# EasyEDA Pro project Ploopy-but-smaller V0.1_2025-08-17.epro, board Trackpad
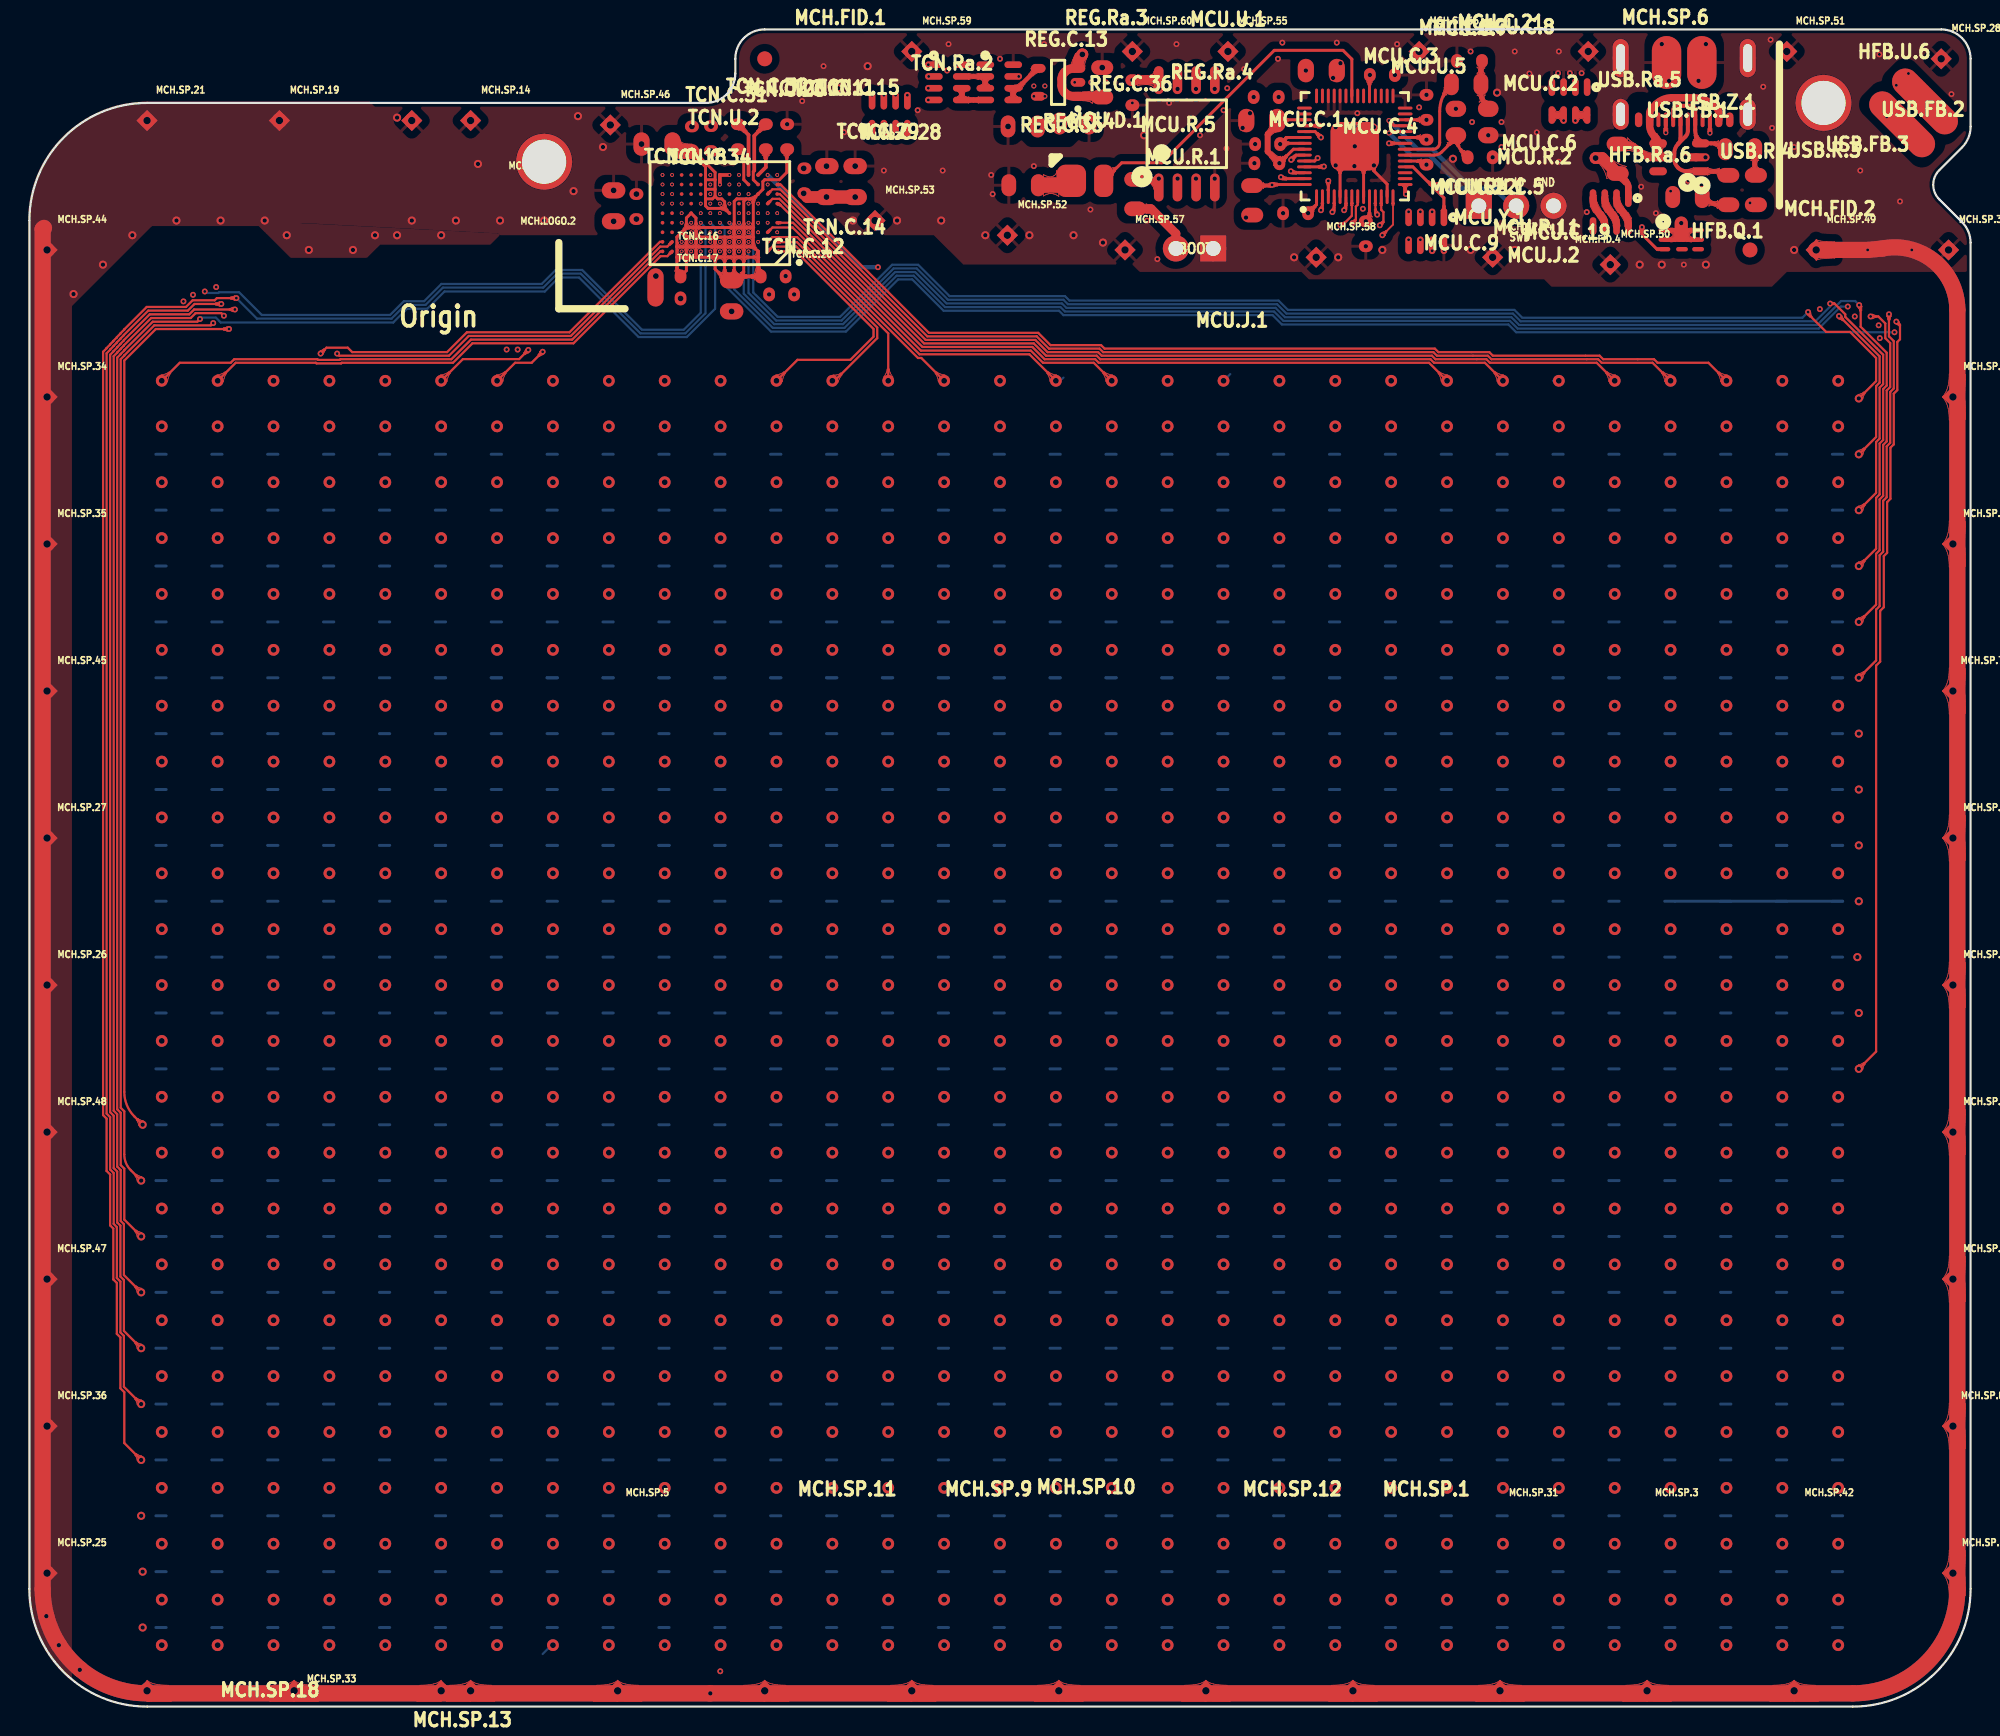
[diagram p0: board, top side]
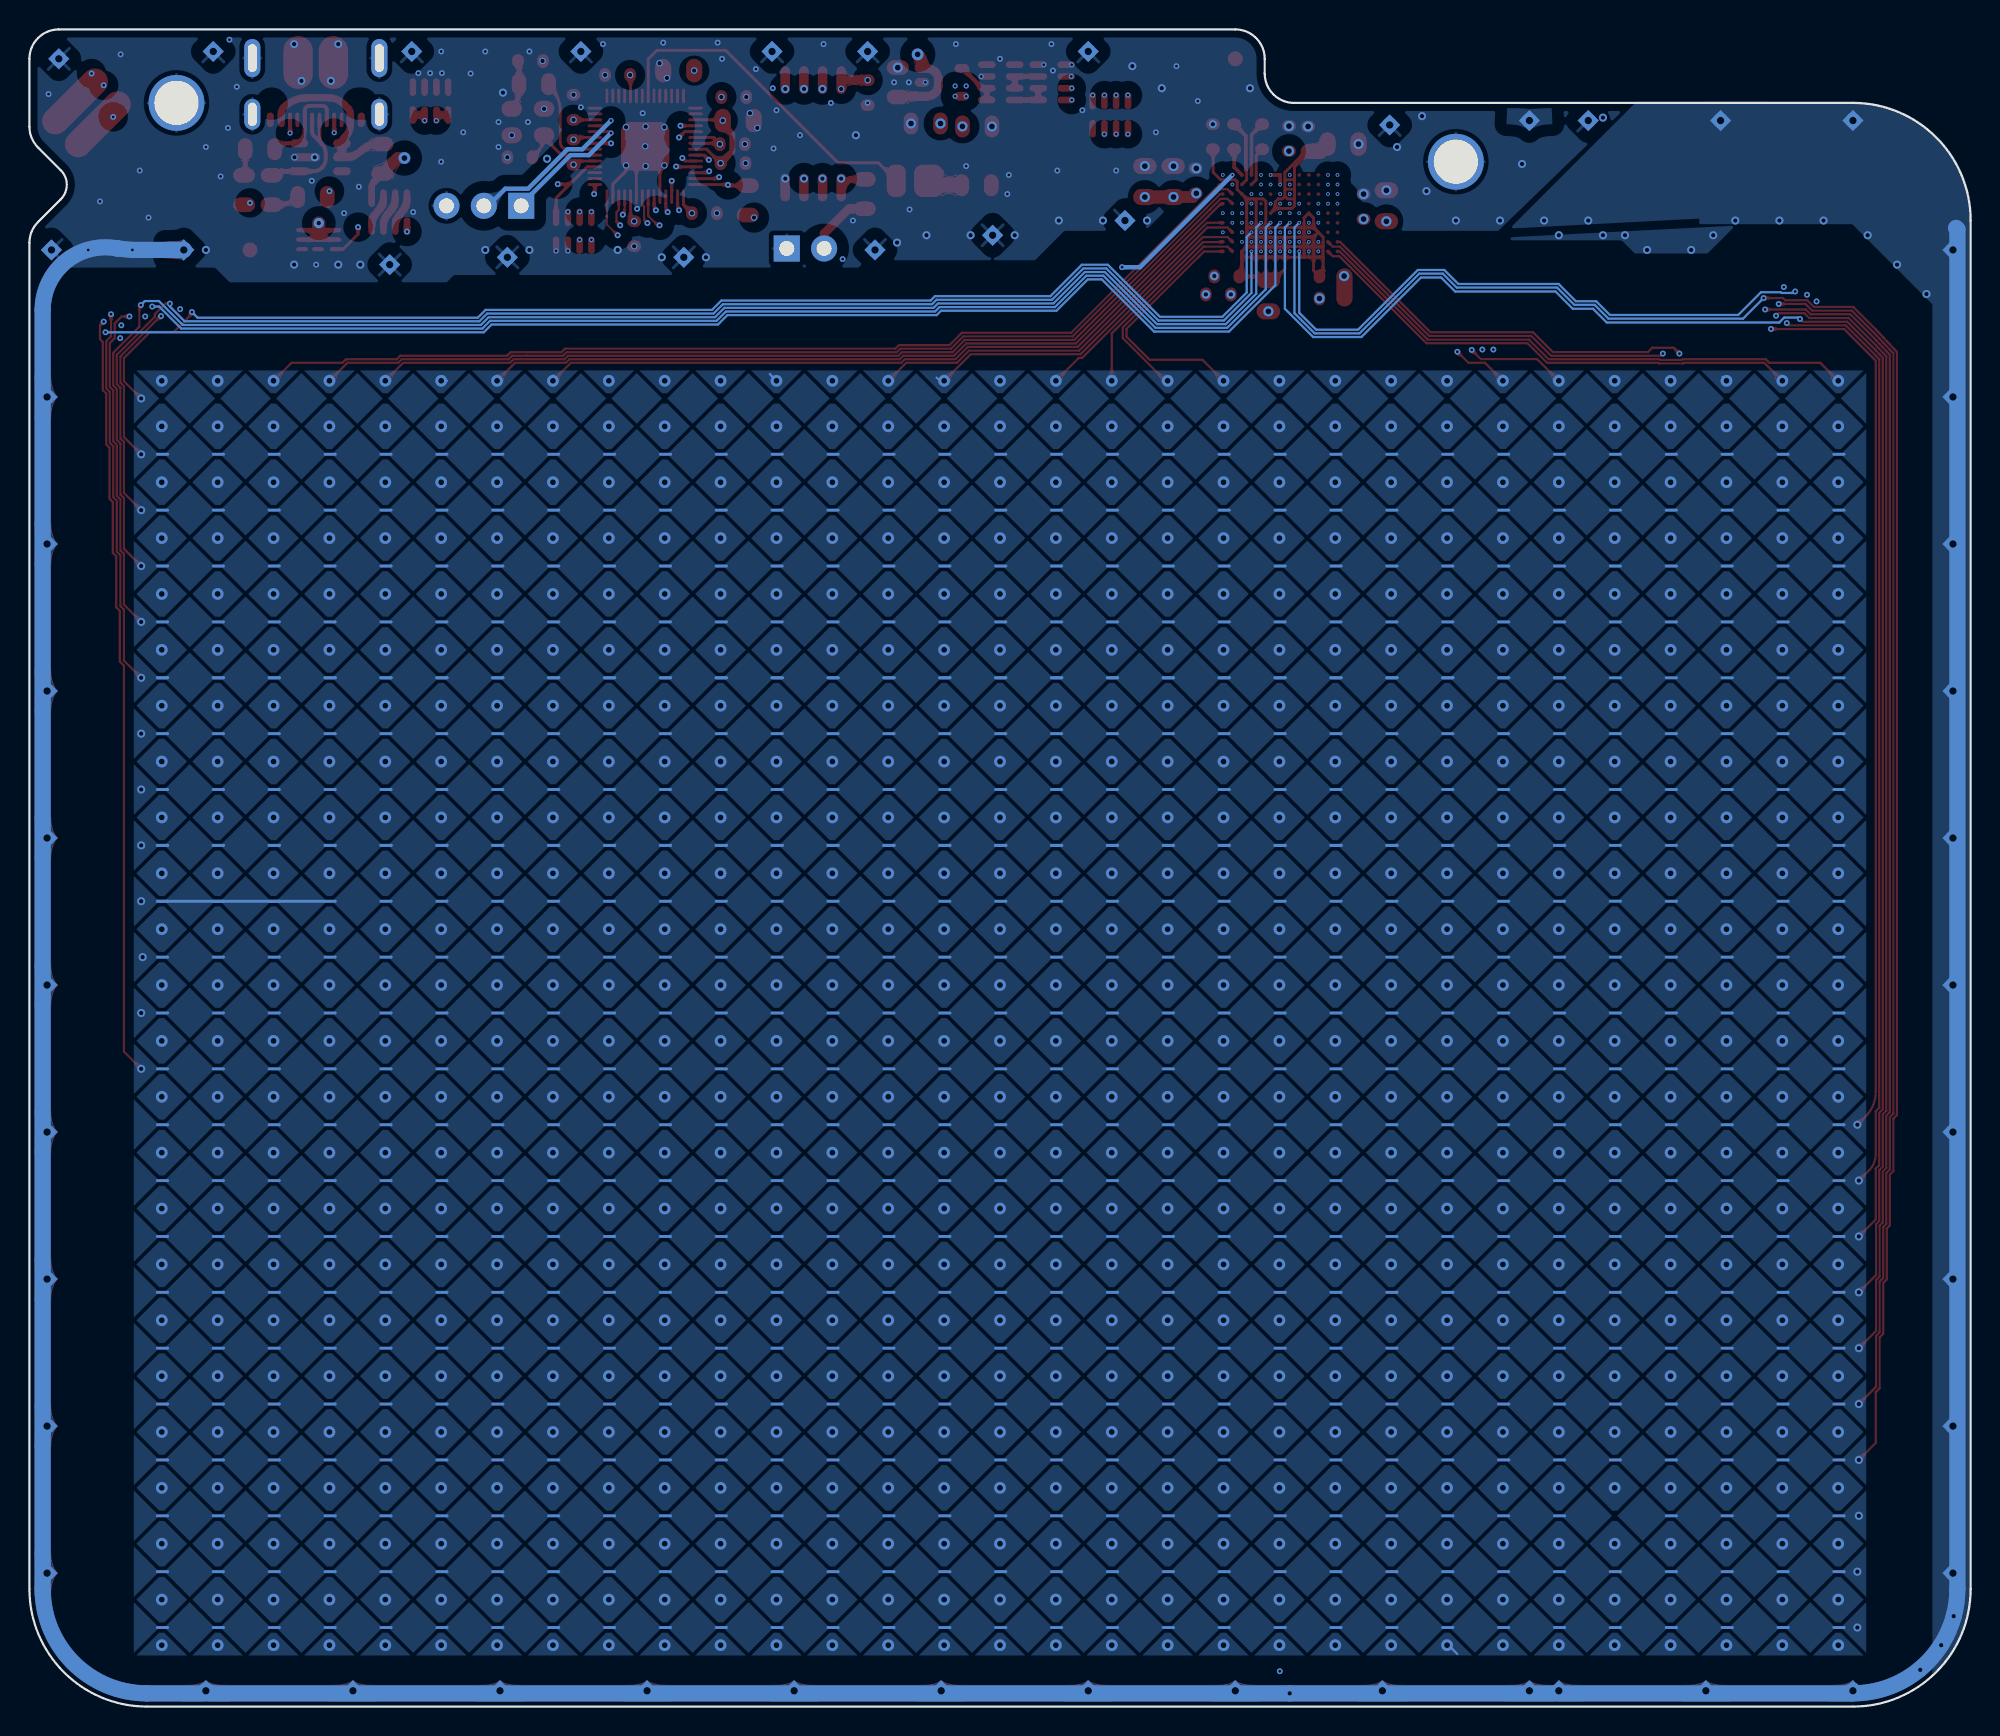
[diagram p1: board, bottom side, seen from below]

Outline 132 x 114.08 mm; copper layers: Top Layer, Inner 1, Inner 2, Inner 3, Inner 4, Bottom Layer. Coordinates in mm from the lower left corner of the outline.
Outline path: 0,101.08 arc(2.34,106.73) 8,109.08 46,109.08 arc(47.42,109.66) 48,111.08 48,112.08 arc(48.59,113.49) 50,114.08 130,114.08 arc(131.42,113.49) 132,112.08 132,107.46 arc(131.85,106.7) 131.42,106.05 129.87,104.5 arc(129.46,103.51) 129.87,102.52 131.42,100.98 arc(131.85,100.33) 132,99.56 132,8 arc(129.66,2.34) 124,0 8,0 arc(2.34,2.34) 0,8 0,101.08
Stack: Top Layer 0.035mm / Dielectric1 0.274mm PP er 4.5 / Inner 1 0.035mm / Dielectric2 0.274mm PP er 4.5 / Inner 2 0.035mm / Dielectric3 0.274mm FR4 er 4.5 / Inner 3 0.035mm / Dielectric4 0.274mm PP er 4.5 / Inner 4 0.035mm / Dielectric5 0.274mm PP er 4.5 / Bottom Layer 0.035mm

## Design rules (mm)
template: User Custom Config
spacing safeClearance (default): track to track 0.089, other pairs 0.152 to 0.3
track width trackWidth (default): min 0.127, default 0.254, max 2.54
differential pair differentialPair (default): width min 0.127, default 0.254, max 2.54; gap min 0.152, default 0.152
via viaSize (default): diameter min 0.5, default 0.61, max 10; hole min 0.3, default 0.305, max 6
net GND uses IgnoreDRC
net 3V3 uses CopperRegion13
net DrivenShield uses CopperRegion8
net Y22 uses IgnoreDRC
pour ie11231 uses CopperRegion2
pour ie11232 uses CopperRegion1
pour ie11233 uses CopperRegion12
pour ie11234 uses CopperRegion7
pour ie11235 uses CopperRegion8
pour ie11237 uses CopperRegion10
pour ie11241 uses CopperRegion6
pour ie11242 uses CopperRegion14
pour ie2408 uses IgnoreDRC

## Placement (name value [footprint] x y rotation side)
HFB.Q.1  CSD16301Q2  [FETs:CSD16301Q2 - SON65P200X80_HS-7M]  112.33 99.78 0 top
HFB.Ra.6  1206 Quad  [Chip_Passives:4x 1R 5% - CAC-80P320X160-8M]  107.53 101.65 270 top
HFB.U.6  MOTOR-VIBRATORY  [Motors:MOTOR-VIBRATORY]  129.96 106.99 135 top
MCH.FID.1  IPC-7351 Fiducial 1mm  [Mechanical:FIDUCIAL_1.5]  50 112.08 90 top
MCH.FID.2  IPC-7351 Fiducial 1mm  [Mechanical:FIDUCIAL_1.5]  117 99.08 90 top
MCH.FID.3  1mm Fiducial for OpenPNP  [Mechanical:FIDUCIAL-NEW]  31.5 103.08 90 top
MCH.FID.4  1mm Fiducial for OpenPNP  [Mechanical:FIDUCIAL-NEW]  104 98.08 90 top
MCH.LOGO.2  Coordinate system marker for assembly  [Graphics:Coordinate System]  36 95.08 0 top
MCH.SP.1  Spark Gap  [PCBFeatures:SparkGap]  90 1.08 90 top
MCH.SP.3  Spark Gap  [PCBFeatures:SparkGap]  110 1.08 90 top
MCH.SP.5  Spark Gap  [PCBFeatures:SparkGap]  40 1.08 90 top
MCH.SP.6  Spark Gap  [PCBFeatures:SparkGap]  106 112.58 90 top
MCH.SP.7  Spark Gap  [PCBFeatures:SparkGap]  130.8 69.08 90 top
MCH.SP.8  Spark Gap  [PCBFeatures:SparkGap]  130.8 19.08 90 top
MCH.SP.9  Spark Gap  [PCBFeatures:SparkGap]  60 1.08 90 top
MCH.SP.10  Spark Gap  [PCBFeatures:SparkGap]  70 1.08 90 top
MCH.SP.11  Spark Gap  [PCBFeatures:SparkGap]  50 1.08 90 top
MCH.SP.12  Spark Gap  [PCBFeatures:SparkGap]  80 1.08 90 top
MCH.SP.13  Spark Gap  [PCBFeatures:SparkGap]  30 1.08 90 top
MCH.SP.14  Spark Gap  [PCBFeatures:SparkGap]  30 107.88 90 top
MCH.SP.16  Spark Gap  [PCBFeatures:SparkGap]  130.8 89.08 90 top
MCH.SP.17  Spark Gap  [PCBFeatures:SparkGap]  130.8 79.08 90 top
MCH.SP.18  Spark Gap  [PCBFeatures:SparkGap]  8 1.08 90 top
MCH.SP.19  Spark Gap  [PCBFeatures:SparkGap]  17 107.88 90 top
MCH.SP.21  Spark Gap  [PCBFeatures:SparkGap]  8 107.88 90 top
MCH.SP.25  Spark Gap  [PCBFeatures:SparkGap]  1.2 9.08 90 top
MCH.SP.26  Spark Gap  [PCBFeatures:SparkGap]  1.2 49.08 90 top
MCH.SP.27  Spark Gap  [PCBFeatures:SparkGap]  1.2 59.08 90 top
MCH.SP.28  Spark Gap  [PCBFeatures:SparkGap]  130 112.08 90 top
MCH.SP.29  Spark Gap  [PCBFeatures:SparkGap]  130.8 59.08 90 top
MCH.SP.30  Spark Gap  [PCBFeatures:SparkGap]  130.8 39.08 90 top
MCH.SP.31  Spark Gap  [PCBFeatures:SparkGap]  100 1.08 90 top
MCH.SP.32  Spark Gap  [PCBFeatures:SparkGap]  28 1.08 90 top
MCH.SP.33  Spark Gap  [PCBFeatures:SparkGap]  18 1.08 90 top
MCH.SP.34  Spark Gap  [PCBFeatures:SparkGap]  1.2 89.08 90 top
MCH.SP.35  Spark Gap  [PCBFeatures:SparkGap]  1.2 79.08 90 top
MCH.SP.36  Spark Gap  [PCBFeatures:SparkGap]  1.2 19.08 90 top
MCH.SP.38  Spark Gap  [PCBFeatures:SparkGap]  130.5 99.08 90 top
MCH.SP.39  Spark Gap  [PCBFeatures:SparkGap]  130.8 49.08 90 top
MCH.SP.40  Spark Gap  [PCBFeatures:SparkGap]  130.8 29.08 90 top
MCH.SP.41  Spark Gap  [PCBFeatures:SparkGap]  130.8 9.08 90 top
MCH.SP.42  Spark Gap  [PCBFeatures:SparkGap]  120 1.08 90 top
MCH.SP.43  Spark Gap  [PCBFeatures:SparkGap]  26 107.88 90 top
MCH.SP.44  Spark Gap  [PCBFeatures:SparkGap]  1.2 99.08 90 top
MCH.SP.45  Spark Gap  [PCBFeatures:SparkGap]  1.2 69.08 90 top
MCH.SP.46  Spark Gap  [PCBFeatures:SparkGap]  39.5 107.58 90 top
MCH.SP.47  Spark Gap  [PCBFeatures:SparkGap]  1.2 29.08 90 top
MCH.SP.48  Spark Gap  [PCBFeatures:SparkGap]  1.2 39.08 90 top
MCH.SP.49  Spark Gap  [PCBFeatures:SparkGap]  121.5 99.08 90 top
MCH.SP.50  Spark Gap  [PCBFeatures:SparkGap]  107.5 98.08 90 top
MCH.SP.51  Spark Gap  [PCBFeatures:SparkGap]  119.5 112.58 90 top
MCH.SP.52  Spark Gap  [PCBFeatures:SparkGap]  66.5 100.08 90 top
MCH.SP.53  Spark Gap  [PCBFeatures:SparkGap]  57.5 101.08 90 top
MCH.SP.54  Spark Gap  [PCBFeatures:SparkGap]  99.5 98.58 90 top
MCH.SP.55  Spark Gap  [PCBFeatures:SparkGap]  81.5 112.58 90 top
MCH.SP.56  Spark Gap  [PCBFeatures:SparkGap]  94.5 112.58 90 top
MCH.SP.57  Spark Gap  [PCBFeatures:SparkGap]  74.5 99.08 90 top
MCH.SP.58  Spark Gap  [PCBFeatures:SparkGap]  87.5 98.58 90 top
MCH.SP.59  Spark Gap  [PCBFeatures:SparkGap]  60 112.58 90 top
MCH.SP.60  Spark Gap  [PCBFeatures:SparkGap]  75 112.58 90 top
MCU.C.1  0603 X5R  [Chip_Passives:0603 CAPACITOR - CAPC1608X06N]  75 109.78 0 top
MCU.C.2  0805 X5R  [Chip_Passives:0805 - TALL]  87.85 111.28 270 top
MCU.C.3  0603 X5R  [Chip_Passives:0603 capacitor - CAPC1608X06N]  86.1 101.58 270 top
MCU.C.4  0603 X5R  [Chip_Passives:0603 CAPACITOR - CAPC1608X06N]  90.88 100.18 0 top
MCU.C.5  0603 X5R  [Chip_Passives:0603 CAPACITOR - CAPC1608X06N]  95 108.78 180 top
MCU.C.6  0603 X5R  [Chip_Passives:0603 capacitor - CAPC1608X06N]  92 110.98 90 top
MCU.C.7  0603 X5R  [Chip_Passives:0603 capacitor - CAPC1608X06N]  84.2 106.28 270 top
MCU.C.8  0603 X5R  [Chip_Passives:0603 capacitor - CAPC1608X06N]  84.1 109.48 270 top
MCU.C.9  0603  [Chip_Passives:0603 capacitor - CAPC1608X06N]  98.65 105.38 270 top
MCU.C.19  0603  [Chip_Passives:0603 capacitor - CAPC1608X06N]  97.93 111.93 270 top
MCU.C.21  0805 X5R  [Chip_Passives:0805 - TALL]  83.8 107.88 90 top
MCU.C.22  0603 X5R  [Chip_Passives:0603 CAPACITOR - CAPC1608X06N]  95 105.73 0 top
MCU.C.24  0603 X5R  [Chip_Passives:0603 capacitor - CAPC1608X06N]  84.15 104.98 270 top
MCU.D.1  SPMWH1228  [LEDs:SPMWH1228]  71.8 103.78 180 top
MCU.J.1  HEADER2  [Connectors:2x1]  80.5 99.18 270 top
MCU.J.2  HEADER3  [Connectors:3x1]  98.56 102.08 90 top
MCU.R.1  0805  [Chip_Passives:0805]  75.2 102.88 180 top
MCU.R.2  0805  [Chip_Passives:0805]  83.15 102.45 180 top
MCU.R.5  0805  [Chip_Passives:0805]  67.6 103.48 90 top
MCU.R.11  0805  [Chip_Passives:0805]  97.7 110.35 90 top
MCU.Ra.1  1206 Quad  [Chip_Passives:4x 10k 1% - CAC-80P320X160-8M]  94.99 100.35 270 top
MCU.U.1  W25Q16JVSSIQ  [Memory:W25Q128JVS - SOIC127P790X216-8M]  78.7 106.98 90 top
MCU.U.5  RP2040  [MCUs:RP2040 - QFN40P700X700X90_HS-57M]  90.13 106.13 90 top
MCU.Y.1  RH100-12.000-16-3030  [Crystals:RH100-12.000-16-3030]  98.1 107.78 0 top
NOREF  -  [footprint_9941]  122 109.08 0 top
NOREF#2  -  [footprint_9941]  35 105.08 0 top
REG.C.13  0805  [Chip_Passives:0805]  67.55 107.48 90 top
REG.C.35  0805  [Chip_Passives:0805]  72.95 110.48 0 top
REG.C.36  0805  [Chip_Passives:0805]  71.05 107.68 270 top
REG.Ra.3  1206 Quad  [Chip_Passives:4x 10k 1% - CAC-80P320X160-8M]  62.45 110.48 0 top
REG.Ra.4  1206 Quad  [Chip_Passives:4x 1k 1% - CAC-80P320X160-8M]  65.95 110.48 0 top
REG.U.4  AP7330-W5  [PowerSupply:AP7330-W5 - SOT95P270X145-5N]  69.95 110.48 180 top
TCN.C.10  0603 X5R  [Chip_Passives:0603 CAPACITOR - CAPC1608X06N]  48.18 106.78 180 top
TCN.C.11  0603 X5R  [Chip_Passives:0603 CAPACITOR - CAPC1608X06N]  50.08 106.78 180 top
TCN.C.12  0805 X5R  [Chip_Passives:0805 - TALL]  47.75 95.95 180 top
TCN.C.14  0603 X5R  [Chip_Passives:0603 capacitor - CAPC1608X06N]  50.58 97.28 90 top
TCN.C.15  0603 X5R  [Chip_Passives:0603 CAPACITOR - CAPC1608X06N]  51.53 106.78 180 top
TCN.C.16  0603 X5R  [Chip_Passives:0603 capacitor - CAPC1608X06N]  43.43 97.28 270 top
TCN.C.17  0603 X5R  [Chip_Passives:0603 capacitor - CAPC1608X06N]  43.43 95.78 270 top
TCN.C.18  0805 X5R  [Chip_Passives:0805 - TALL]  39.73 102.08 0 top
TCN.C.20  0603 X5R  [Chip_Passives:0603 capacitor - CAPC1608X06N]  51.15 96.05 90 top
TCN.C.23  0805 X5R  [Chip_Passives:0805 - TALL]  56.15 103.73 0 top
TCN.C.26  0603 X5R  [Chip_Passives:0603 CAPACITOR - CAPC1608X06N]  46.35 106.65 180 top
TCN.C.28  0805 X5R  [Chip_Passives:0805 - TALL]  54.23 103.73 0 top
TCN.C.29  0603 X5R  [Chip_Passives:0603 CAPACITOR - CAPC1608X06N]  52.7 103.78 180 top
TCN.C.31  0805 X5R  [Chip_Passives:0805 - TALL]  42.68 106.28 90 top
TCN.C.32  0603 X5R  [Chip_Passives:0603 CAPACITOR - CAPC1608X06N]  45.05 106.63 180 top
TCN.C.34  0603 X5R  [Chip_Passives:0603 CAPACITOR - CAPC1608X06N]  41.28 102.03 180 top
TCN.Ra.2  1206 Quad  [Chip_Passives:4x 1k 1% - CAC-80P320X160-8M]  58.5 108.28 90 top
TCN.U.2  ATMXT1066TD-NHU  [CapSense:ATMXT1066TD-NHU - BGA117C65P13X9_950X700X65]  46.95 101.58 180 top
USB.FB.1  ACML-0805-601-T  [Chip_Passives:0805]  108 105.28 0 top
USB.FB.2  ACML-0805-601-T  [Chip_Passives:0805]  116.33 105.93 90 top
USB.FB.3  ACML-0805-601-T  [Chip_Passives:0805]  115.53 103.15 0 top
USB.J.3  DX07S016JA1R1500  [Connectors:DX07S016JA1R1500]  112.53 110.93 180 top
USB.R.3  0805  [Chip_Passives:0805]  117.4 103.15 0 top
USB.R.4  0805  [Chip_Passives:0805]  112.75 102.68 270 top
USB.Ra.5  1206 Quad  [Chip_Passives:4x 10k 1% - CAC-80P320X160-8M]  104.73 109.2 270 top
USB.Z.1  IP4220CZ6,125  [Diodes:PESD3V3S4UD - SOT95P275X110-6N]  112.2 105.38 180 top

## Footprints (pads in the part's own frame, mm; a bottom-side part is the same pattern mirrored in y, then rotated)
CapSense:ATMXT1066TD-NHU - BGA117C65P13X9_950X700X65
  round 0.25 smd: A1(-3.9,2.6) A2(-3.25,2.6) A3(-2.6,2.6) A4(-1.95,2.6) A5(-1.3,2.6) A6(-0.65,2.6) A7(0,2.6) A8(0.65,2.6) A9(1.3,2.6) A10(1.95,2.6) A11(2.6,2.6) A12(3.25,2.6) A13(3.9,2.6) B1(-3.9,1.95) B2(-3.25,1.95) B3(-2.6,1.95) B4(-1.95,1.95) B5(-1.3,1.95) B6(-0.65,1.95) B7(0,1.95) B8(0.65,1.95) B9(1.3,1.95) B10(1.95,1.95) B11(2.6,1.95) B12(3.25,1.95) B13(3.9,1.95) C1(-3.9,1.3) C2(-3.25,1.3) C3(-2.6,1.3) C4(-1.95,1.3) C5(-1.3,1.3) C6(-0.65,1.3) C7(0,1.3) C8(0.65,1.3) C9(1.3,1.3) C10(1.95,1.3) C11(2.6,1.3) C12(3.25,1.3) C13(3.9,1.3) D1(-3.9,0.65) D2(-3.25,0.65) D3(-2.6,0.65) D4(-1.95,0.65) D5(-1.3,0.65) D6(-0.65,0.65) D7(0,0.65) D8(0.65,0.65) D9(1.3,0.65) D10(1.95,0.65) D11(2.6,0.65) D12(3.25,0.65) D13(3.9,0.65) E1(-3.9,0) E2(-3.25,0) E3(-2.6,0) E4(-1.95,0) E5(-1.3,0) E6(-0.65,0) E7(0,0) E8(0.65,0) E9(1.3,0) E10(1.95,0) E11(2.6,0) E12(3.25,0) E13(3.9,0) F1(-3.9,-0.65) F2(-3.25,-0.65) F3(-2.6,-0.65) F4(-1.95,-0.65) F5(-1.3,-0.65) F6(-0.65,-0.65) F7(0,-0.65) F8(0.65,-0.65) F9(1.3,-0.65) F10(1.95,-0.65) F11(2.6,-0.65) F12(3.25,-0.65) F13(3.9,-0.65) G1(-3.9,-1.3) G2(-3.25,-1.3) G3(-2.6,-1.3) G4(-1.95,-1.3) G5(-1.3,-1.3) G6(-0.65,-1.3) G7(0,-1.3) G8(0.65,-1.3) G9(1.3,-1.3) G10(1.95,-1.3) G11(2.6,-1.3) G12(3.25,-1.3) G13(3.9,-1.3) H1(-3.9,-1.95) H2(-3.25,-1.95) H3(-2.6,-1.95) H4(-1.95,-1.95) H5(-1.3,-1.95) H6(-0.65,-1.95) H7(0,-1.95) H8(0.65,-1.95) H9(1.3,-1.95) H10(1.95,-1.95) H11(2.6,-1.95) H12(3.25,-1.95) H13(3.9,-1.95) J1(-3.9,-2.6) J2(-3.25,-2.6) J3(-2.6,-2.6) J4(-1.95,-2.6) J5(-1.3,-2.6) J6(-0.65,-2.6) J7(0,-2.6) J8(0.65,-2.6) J9(1.3,-2.6) J10(1.95,-2.6) J11(2.6,-2.6) J12(3.25,-2.6) J13(3.9,-2.6)
Chip_Passives:4x 1k 1% - CAC-80P320X160-8M
  oval 1.2x0.45 smd: 1(-0.95,1.2) 2(-0.95,0.4) 3(-0.95,-0.4) 4(-0.95,-1.2) 5(0.95,-1.2) 6(0.95,-0.4) 7(0.95,0.4) 8(0.95,1.2)
Chip_Passives:4x 1R 5% - CAC-80P320X160-8M
  oval 1.2x0.45 smd: 1(-0.95,1.2) 2(-0.95,0.4) 3(-0.95,-0.4) 4(-0.95,-1.2) 5(0.95,-1.2) 6(0.95,-0.4) 7(0.95,0.4) 8(0.95,1.2)
Chip_Passives:4x 10k 1% - CAC-80P320X160-8M
  oval 1.2x0.45 smd: 1(-0.95,1.2) 2(-0.95,0.4) 3(-0.95,-0.4) 4(-0.95,-1.2) 5(0.95,-1.2) 6(0.95,-0.4) 7(0.95,0.4) 8(0.95,1.2)
Chip_Passives:0603 capacitor - CAPC1608X06N
  rrect 0.95x0.8 smd: 1(0,-0.85) 2(0,0.85)
Chip_Passives:0603 CAPACITOR - CAPC1608X06N
  rrect 0.95x0.8 smd: 1(0,-0.85) 2(0,0.85)
Chip_Passives:0805
  rrect 1.5x1 smd: 1(0,1.002) 2(0,-1.002)
Chip_Passives:0805 - TALL
  rrect 1.6x1.1 smd: 1(0,1.052) 2(0,-1.052)
Connectors:2x1
  rect 1.778x1.778 hole 1.016: 1(0,0)
  round 1.778 hole 1.016: 2(0,-2.54)
Connectors:3x1
  rect 1.778x1.778 hole 1.016: 1(0,0)
  round 1.778 hole 1.016: 2(0,-2.54) 3(0,-5.08)
Connectors:DX07S016JA1R1500
  round 0.001 hole 0.6: (-3,1.9)
  round 0.001 hole 0.85x0.6: (3,1.9)
  rrect 0.5x1 smd: 1(-3.1,3) 2(-2.35,3) 11(2.35,3) 12(3.1,3)
  rrect 0.27x1 smd: 3(-1.75,3) 4(-1.25,3) 5(-0.75,3) 6(-0.25,3) 7(0.25,3) 8(0.75,3) 9(1.25,3) 10(1.75,3)
  rrect 1.1x2.1 hole 0.6x1.6: SHELL(-4.32,2.625) SHELL(4.32,2.625)
  rrect 1.1x2.6 hole 0.6x1.9: SHELL(-4.32,-1.2) SHELL(4.32,-1.2)
  rrect 2x3.6 smd: SHELL(-1.2,-0.9) SHELL(1.2,-0.9)
Crystals:RH100-12.000-16-3030
  rrect 1.4x1.1 smd: 1(-1.1,-0.9) 2(1.1,-0.9) 3(1.1,0.9) 4(-1.1,0.9)
Diodes:PESD3V3S4UD - SOT95P275X110-6N
  rrect 1.2x0.55 smd: 1(-1.45,0.95) 2(-1.45,0) 3(-1.45,-0.95) 4(1.45,-0.95) 5(1.45,0) 6(1.45,0.95)
FETs:CSD16301Q2 - SON65P200X80_HS-7M
  rrect 0.8x0.3 smd: D(-1.145,0.65) D(-1.145,0) D(1.145,0.65) D(1.145,0) G(-1.145,-0.65) S(0.05,-0.65) S(1.145,-0.65)
  rrect 0.9x0.95 smd: D(0,0.325)
footprint_9941
  round 3.8 hole 3: 4(0,0)
LEDs:SPMWH1228
  rrect 1.3x2.2 smd: 1(-1.25,0)
  rrect 2x2.2 smd: 2(0.95,0)
MCUs:RP2040 - QFN40P700X700X90_HS-57M
  oval 1x0.2 smd: 1(-3.425,2.6) 2(-3.425,2.2) 3(-3.425,1.8) 4(-3.425,1.4) 5(-3.425,1) 6(-3.425,0.6) 7(-3.425,0.2) 8(-3.425,-0.2) 9(-3.425,-0.6) 10(-3.425,-1) 11(-3.425,-1.4) 12(-3.425,-1.8) 13(-3.425,-2.2) 14(-3.425,-2.6) 29(3.425,-2.6) 30(3.425,-2.2) 31(3.425,-1.8) 32(3.425,-1.4) 33(3.425,-1) 34(3.425,-0.6) 35(3.425,-0.2) 36(3.425,0.2) 37(3.425,0.6) 38(3.425,1) 39(3.425,1.4) 40(3.425,1.8) 41(3.425,2.2) 42(3.425,2.6)
  oval 0.2x1 smd: 15(-2.6,-3.425) 16(-2.2,-3.425) 17(-1.8,-3.425) 18(-1.4,-3.425) 19(-1,-3.425) 20(-0.6,-3.425) 21(-0.2,-3.425) 22(0.2,-3.425) 23(0.6,-3.425) 24(1,-3.425) 25(1.4,-3.425) 26(1.8,-3.425) 27(2.2,-3.425) 28(2.6,-3.425) 43(2.6,3.425) 44(2.2,3.425) 45(1.8,3.425) 46(1.4,3.425) 47(1,3.425) 48(0.6,3.425) 49(0.2,3.425) 50(-0.2,3.425) 51(-0.6,3.425) 52(-1,3.425) 53(-1.4,3.425) 54(-1.8,3.425) 55(-2.2,3.425) 56(-2.6,3.425)
  rrect 3.3x3.3 smd: 57(0,0)
Mechanical:FIDUCIAL_1.5
  round 1.016 smd: 1(0,0)
Memory:W25Q128JVS - SOIC127P790X216-8M
  oval 1.9x0.65 smd: 1(-3.65,1.905) 2(-3.65,0.635) 3(-3.65,-0.635) 4(-3.65,-1.905) 5(3.65,-1.905) 6(3.65,-0.635) 7(3.65,0.635) 8(3.65,1.905)
Motors:MOTOR-VIBRATORY
  rrect 5.6x1.8 smd: 1(2.3,1.4) 2(2.3,-0.8)
PCBFeatures:SparkGap
  rect 1.016x1.016 smd rot 45: 1(0,0)
  rect 1.016x1.016 smd far side rot 45: 1(0,0)
PowerSupply:AP7330-W5 - SOT95P270X145-5N
  rrect 1x0.6 smd: 1(-1.35,0.95) 2(-1.35,0) 3(-1.35,-0.95) 4(1.35,-0.95) 5(1.35,0.95)

## Nets
1V1: MCU.C.21.2 MCU.C.22.2 MCU.C.24.2 MCU.U.5.23 MCU.U.5.45 MCU.U.5.50
3V3: MCU.C.1.2 MCU.C.2.2 MCU.C.3.2 MCU.C.4.2 MCU.C.5.2 MCU.C.6.2 MCU.C.7.2 MCU.C.8.2 MCU.R.2.1 MCU.Ra.1.5 MCU.Ra.1.6 MCU.U.1.8 MCU.U.5.1 MCU.U.5.10 MCU.U.5.22 MCU.U.5.26 MCU.U.5.33 MCU.U.5.42 MCU.U.5.43 MCU.U.5.44 MCU.U.5.48 MCU.U.5.49 REG.C.13.2 REG.C.36.2 REG.Ra.3.3 REG.Ra.3.4 REG.U.4.5 TCN.C.17.2 TCN.C.18.2 TCN.C.20.2 TCN.C.23.2 TCN.C.26.2 TCN.C.28.2 TCN.C.29.2 TCN.C.34.2 TCN.Ra.2.6 TCN.Ra.2.7 TCN.Ra.2.8 TCN.U.2.A11 TCN.U.2.D4 TCN.U.2.E4 TCN.U.2.E7 TCN.U.2.E9 TCN.U.2.F4
GND: HFB.Q.1.S MCH.SP.1.1 MCH.SP.3.1 MCH.SP.5.1 MCH.SP.6.1 MCH.SP.7.1 MCH.SP.8.1 MCH.SP.9.1 MCH.SP.10.1 MCH.SP.11.1 MCH.SP.12.1 MCH.SP.13.1 MCH.SP.14.1 MCH.SP.16.1 MCH.SP.17.1 MCH.SP.18.1 MCH.SP.19.1 MCH.SP.21.1 MCH.SP.25.1 MCH.SP.26.1 MCH.SP.27.1 MCH.SP.28.1 MCH.SP.29.1 MCH.SP.30.1 MCH.SP.31.1 MCH.SP.32.1 MCH.SP.33.1 MCH.SP.34.1 MCH.SP.35.1 MCH.SP.36.1 MCH.SP.38.1 MCH.SP.39.1 MCH.SP.40.1 MCH.SP.41.1 MCH.SP.42.1 MCH.SP.43.1 MCH.SP.44.1 MCH.SP.45.1 MCH.SP.46.1 MCH.SP.47.1 MCH.SP.48.1 MCH.SP.49.1 MCH.SP.50.1 MCH.SP.51.1 MCH.SP.52.1 MCH.SP.53.1 MCH.SP.54.1 MCH.SP.55.1 MCH.SP.56.1 MCH.SP.57.1 MCH.SP.58.1 MCH.SP.59.1 MCH.SP.60.1 MCU.C.1.1 MCU.C.2.1 MCU.C.3.1 MCU.C.4.1 MCU.C.5.1 MCU.C.6.1 MCU.C.7.1 MCU.C.8.1 MCU.C.9.2 MCU.C.19.1 MCU.C.21.1 MCU.C.22.1 MCU.C.24.1 MCU.J.1.1 MCU.J.2.3 MCU.R.5.1 MCU.Ra.1.2 MCU.Ra.1.7 MCU.Ra.1.8 MCU.U.1.4 MCU.U.5.5 MCU.U.5.9 MCU.U.5.13 MCU.U.5.16 MCU.U.5.17 MCU.U.5.19 MCU.U.5.27 MCU.U.5.28 MCU.U.5.29 MCU.U.5.30 MCU.U.5.31 MCU.U.5.32 MCU.U.5.34 MCU.U.5.35 MCU.U.5.37 MCU.U.5.38 MCU.U.5.39 MCU.U.5.40 MCU.U.5.41 MCU.U.5.57 MCU.Y.1.2 MCU.Y.1.4 NOREF.4 NOREF#2.4 REG.C.13.1 REG.C.35.1 REG.C.36.1 REG.Ra.3.1 REG.Ra.3.2 REG.Ra.3.8 REG.Ra.4.1 REG.Ra.4.7 REG.Ra.4.8 REG.U.4.2 TCN.C.12.1 TCN.C.14.1 TCN.C.15.1 TCN.C.16.1 TCN.C.17.1 TCN.C.18.1 TCN.C.20.1 TCN.C.23.1 TCN.C.26.1 TCN.C.28.1 TCN.C.29.1 TCN.C.31.1 TCN.C.32.1 TCN.C.34.1 TCN.Ra.2.4 TCN.Ra.2.5 TCN.U.2.B3 TCN.U.2.B11 TCN.U.2.C3 TCN.U.2.D10 TCN.U.2.E5 TCN.U.2.E8 TCN.U.2.G5 TCN.U.2.G7 TCN.U.2.H7 TCN.U.2.H8 TCN.U.2.J6 TCN.U.2.J7 USB.J.3.1 USB.J.3.12 USB.J.3.SHELL USB.Ra.5.1 USB.Ra.5.2 USB.Ra.5.3 USB.Ra.5.4 USB.Z.1.2
DRIVENSHIELD: TCN.U.2.J2
NETHFB.Q.1_D: HFB.Q.1.D HFB.U.6.2
NETHFB.Q.1_G: HFB.Q.1.G MCU.Ra.1.1 MCU.U.5.18
NETHFB.RA.6_1: HFB.Ra.6.1 REG.C.35.2 REG.U.4.1 REG.U.4.3 USB.FB.1.2
NETHFB.RA.6_2: HFB.Ra.6.2 HFB.Ra.6.8
NETHFB.RA.6_3: HFB.Ra.6.3 HFB.Ra.6.7
NETHFB.RA.6_4: HFB.Ra.6.4 HFB.Ra.6.6
NETHFB.RA.6_5: HFB.Ra.6.5 HFB.U.6.1
NETMCU.C.9_1: MCU.C.9.1 MCU.U.5.20 MCU.Y.1.1
NETMCU.C.19_2: MCU.C.19.2 MCU.R.11.2 MCU.Y.1.3
NETMCU.D.1_1: MCU.D.1.1 MCU.U.5.36
NETMCU.D.1_2: MCU.D.1.2 MCU.R.5.2
NETMCU.J.1_2: MCU.J.1.2 MCU.R.1.1
NETMCU.J.2_1: MCU.J.2.1 MCU.U.5.24
NETMCU.J.2_2: MCU.J.2.2 MCU.U.5.25
NETMCU.R.1_2: MCU.R.1.2 MCU.R.2.2 MCU.U.1.1 MCU.U.5.56
NETMCU.R.11_1: MCU.R.11.1 MCU.U.5.21
NETMCU.RA.1_3: MCU.Ra.1.3 MCU.U.5.3 TCN.U.2.F9
NETMCU.RA.1_4: MCU.Ra.1.4 MCU.U.5.15 TCN.U.2.G4
NETMCU.U.1_2: MCU.U.1.2 MCU.U.5.55
NETMCU.U.1_3: MCU.U.1.3 MCU.U.5.54
NETMCU.U.1_5: MCU.U.1.5 MCU.U.5.53
NETMCU.U.1_6: MCU.U.1.6 MCU.U.5.52
NETMCU.U.1_7: MCU.U.1.7 MCU.U.5.51
NETMCU.U.5_2: MCU.U.5.2 TCN.U.2.F8
NETMCU.U.5_4: MCU.U.5.4 TCN.U.2.G8
NETMCU.U.5_6: MCU.U.5.6 TCN.U.2.J8
NETMCU.U.5_7: MCU.U.5.7 TCN.U.2.F7
NETMCU.U.5_8: MCU.U.5.8 TCN.U.2.H6
NETMCU.U.5_11: MCU.U.5.11 TCN.Ra.2.1 TCN.U.2.H5
NETMCU.U.5_12: MCU.U.5.12 TCN.Ra.2.2 TCN.U.2.J5
NETMCU.U.5_14: MCU.U.5.14 TCN.Ra.2.3 TCN.U.2.F6
NETMCU.U.5_46: MCU.U.5.46 USB.R.3.2
NETMCU.U.5_47: MCU.U.5.47 USB.R.4.2
NETREG.RA.3_5: REG.Ra.3.5 REG.Ra.3.6 REG.Ra.4.4
NETREG.RA.3_7: REG.Ra.3.7 REG.Ra.4.2 REG.Ra.4.3
NETREG.RA.4_5: REG.Ra.4.5 REG.Ra.4.6 REG.U.4.4
NETTCN.C.10_1: TCN.C.10.1 TCN.U.2.J4
NETTCN.C.10_2: TCN.C.10.2 TCN.U.2.H4
NETTCN.C.11_1: TCN.C.11.1 TCN.U.2.H3
NETTCN.C.11_2: TCN.C.11.2 TCN.U.2.J3
NETTCN.C.12_2: TCN.C.12.2 TCN.C.14.2 TCN.C.15.2 TCN.C.16.2 TCN.U.2.A3 TCN.U.2.C11 TCN.U.2.E10 TCN.U.2.G3
NETTCN.C.31_2: TCN.C.31.2 TCN.C.32.2 TCN.U.2.E6
NETUSB.FB.1_1: USB.FB.1.1 USB.J.3.2 USB.J.3.11 USB.Z.1.4 USB.Z.1.5
NETUSB.FB.2_1: USB.FB.2.1 USB.J.3.5 USB.J.3.8 USB.Z.1.3
NETUSB.FB.2_2: USB.FB.2.2 USB.R.3.1
NETUSB.FB.3_1: USB.FB.3.1 USB.J.3.6 USB.J.3.7 USB.Z.1.1
NETUSB.FB.3_2: USB.FB.3.2 USB.R.4.1
NETUSB.J.3_3: USB.J.3.3 USB.Ra.5.5 USB.Ra.5.6
NETUSB.J.3_9: USB.J.3.9 USB.Ra.5.7 USB.Ra.5.8
X0: TCN.U.2.A13
X1: TCN.U.2.A12
X2: TCN.U.2.B13
X3: TCN.U.2.B12
X4: TCN.U.2.C13
X5: TCN.U.2.C12
X6: TCN.U.2.D13
X7: TCN.U.2.D12
X8: TCN.U.2.D11
X9: TCN.U.2.E13
X10: TCN.U.2.E12
X11: TCN.U.2.E11
X12: TCN.U.2.F13
X13: TCN.U.2.F12
X14: TCN.U.2.F11
X15: TCN.U.2.G13
X16: TCN.U.2.G12
X17: TCN.U.2.H13
X18: TCN.U.2.H12
X19: TCN.U.2.J13
X20: TCN.U.2.J12
X21: TCN.U.2.A1
X22: TCN.U.2.A2
X23: TCN.U.2.B1
X24: TCN.U.2.B2
X25: TCN.U.2.C1
X26: TCN.U.2.C2
X27: TCN.U.2.D1
X28: TCN.U.2.D2
X29: TCN.U.2.D3
X30: TCN.U.2.E1
X31: TCN.U.2.E2
X32: TCN.U.2.E3
X33: TCN.U.2.F1
X34: TCN.U.2.F2
X35: TCN.U.2.F3
X36: TCN.U.2.G1
X37: TCN.U.2.G2
X38: TCN.U.2.H1
X39: TCN.U.2.H2
X40: TCN.U.2.J1
Y0: TCN.U.2.A10
Y1: TCN.U.2.B10
Y2: TCN.U.2.C10
Y3: TCN.U.2.A9
Y4: TCN.U.2.B9
Y5: TCN.U.2.C9
Y6: TCN.U.2.D9
Y7: TCN.U.2.A8
Y8: TCN.U.2.B8
Y9: TCN.U.2.C8
Y10: TCN.U.2.D8
Y11: TCN.U.2.A7
Y12: TCN.U.2.B7
Y13: TCN.U.2.C7
Y14: TCN.U.2.D7
Y15: TCN.U.2.A6
Y16: TCN.U.2.B6
Y17: TCN.U.2.C6
Y18: TCN.U.2.D6
Y19: TCN.U.2.A5
Y20: TCN.U.2.B5
Y21: TCN.U.2.C5
Y22: TCN.U.2.D5
Y23: TCN.U.2.A4
Y24: TCN.U.2.B4
Y25: TCN.U.2.C4

Pads without a net: MCH.FID.1 1; MCH.FID.2 1; TCN.U.2 F5 F10 G6 G9 G10 G11 H9 H10 H11 J9 J10 J11; USB.J.3 4 10; USB.Z.1 6

## Via types
v1: diameter 0.4, hole 0.2, Top Layer to Bottom Layer, 121 vias
v2: diameter 1.016, hole 0.508, Top Layer to Bottom Layer, 52 vias
v3: diameter 0.55, hole 0.3, Top Layer to Bottom Layer, 82 vias
v4: diameter 0.25, hole 0.15, Top Layer to Bottom Layer, 74 vias
v5: diameter 0.35, hole 0.2, Top Layer to Bottom Layer, 31 vias
v6: diameter 0.45, hole 0.3, Top Layer to Bottom Layer, 37 vias
v7: diameter 0.7, hole 0.4, Top Layer to Bottom Layer, 22 vias
v8: diameter 0.6, hole 0.3, Top Layer to Bottom Layer, 3 vias
v9: diameter 0.7, hole 0.3, Top Layer to Bottom Layer, 2 vias
v10: diameter 0.8, hole 0.4, Top Layer to Bottom Layer, 746 vias

## Routing (per net, layer and track width the routed paths; a pad name or vN(x,y) marks a point on that pad's centre or on a via; arc(x,y) is an arc through that point)
1V1: length 20.5
  Top Layer w0.2: MCU.U.5.50 85.95,105.93 v6(85,104.98) ; MCU.U.5.23 94.76,106.73 arc(94.89,106.75) 95,106.83 ; v6(84.85,107.88) 84.9,107.93 MCU.U.5.45
  Top Layer w0.4: v6(84.85,107.88) 84.85,107.58 84.2,106.93 84.2,105.78 v6(85,104.98)
  Inner 1 w0.4: v6(84.85,107.88) 85.88,108.9 92.68,108.9 v6(95,106.58)
3V3: length 19.4
  Top Layer w0.2: 85.1,106.33 MCU.U.5.49 ; 85.1,106.33 v6(85.05,106.28) ; 85.1,106.33 85.5,106.73 MCU.U.5.48 ; MCU.U.5.33 91.13,110.92 arc(91.13,110.95) v6(91.15,110.98) ; v6(86.95,101.58) 87.53,102.15 MCU.U.5.1 ; MCU.U.5.26 v6(95,107.93) ; 91.13,101.09 MCU.U.5.10 ; v1(92.45,106.33) MCU.U.5.22 ; 90.9,101.09 arc(90.89,101.06) v6(90.88,101.03)
  Top Layer w0.6: v6(75,110.63) MCU.U.1.8
  Top Layer w0.8: v7(52.65,102.93) 52.9,102.68 v7(54.2,102.68)
  Top Layer w0.9: v7(54.2,102.68) 54.2,102.68 v7(56.15,102.68)
  Inner 3 w0.4: v5(57.3,109.6) v5(58.1,109.6) v5(58.9,109.6)
  Inner 3 w0.9: 49.73,97.83 49.73,97.44 arc(49.88,96.69) v8(50.3,96.05)
  vias: v4(44.35,98.98) v4(45.65,101.58) v4(46.95,101.58) v4(48.9,102.23) v4(48.9,101.58) v4(48.9,100.93) v5(61.13,110.08) v5(61.13,109.28) v5(68.3,110.23) v5(68.3,109.53) v5(69.05,110.23) v5(69.05,109.53) v5(93.79,99.77) v5(94.59,99.77) v6(76.8,110.03) v6(82.73,101.28) v6(84.95,109.48) v6(86.8,111.28) v7(39.73,101.03) v7(41.28,101.18) v7(44.28,95.78) v7(46.35,105.8) v7(68.55,107.48) v7(70.05,107.68)
GND: length 849.4
  Top Layer w0.2: MCU.U.5.9 90.73,105.53 v6(90.13,106.13) 89.13,105.13 MCU.U.5.5 ; v6(91.43,104.83) 91.43,104.45 92.33,103.55 MCU.U.5.13 ; MCU.U.5.19 95,105.13
  Top Layer w0.25: v4(46.95,103.53) TCN.U.2.J7 v4(47.6,104.18)
  Top Layer w0.55: 112.5,105.38 113.33,105.38
  Top Layer w1.1: 0.99,100.57 0.9,100.48 0.9,8 arc(0.96,7.07) 1.15,6.15 arc(1.5,5.13) 2.01,4.18 arc(2.67,3.31) 3.46,2.54 arc(5.59,1.32) 8,0.9 ; v9(46.3,0.9) 8.1,0.9 8,1 arc(8.11,0.93) 8.24,0.9 ; v2(121.5,99.08) v1(125,99.08) 126.02,99.18 arc(129.55,98.29) 131.1,95 131.1,8 arc(129.02,2.98) 124,0.9 120.1,0.9 ; 46.28,0.9 119.76,0.9 ; TCN.C.17.1 TCN.C.16.1 ; 119.76,0.97 arc(119.89,1) v2(120,1.08) arc(120.03,1) 120.1,0.97
  Inner 1 w1.1: 49.9,0.9 v9(46.3,0.9) 41.6,0.9
  Inner 2 w0.25: v4(49.55,100.28) 49.88,99.95
  Inner 2 w0.6: 49.99,99.19 49.99,97.27 47.75,95.03 ; 49.99,99.19 51.11,98.07 arc(51.34,97.72) v8(51.43,97.3) ; 49.99,99.19 v4(49.55,99.63) 49.55,97.63 47.75,95.83 47.75,95.03 ; 47.75,95.03 v7(47.75,94.9) ; v8(51.43,97.3) 51.43,97.35 arc(51.23,98.32) 50.68,99.15 49.88,99.95 arc(50.11,99.91) 50.3,99.78 ; v8(51.43,97.3) arc(51.55,96.68) 51.9,96.15 v8(52,96.05) 52,97.45 arc(51.81,98.42) 51.26,99.25 50.73,99.78 arc(50.56,99.85) 50.43,99.98
  Inner 2 w1.1: v9(46.3,0.9) 8.1,0.9 ; 120.1,0.9 124,0.9 arc(129.02,2.98) 131.1,8 ; 46.28,0.9 119.76,0.9 ; v7(42.6,97.3) 42.6,98.4 43.78,99.58 ; 0.9,8 arc(0.96,7.07) 1.15,6.15 arc(1.5,5.13) 2.01,4.18 arc(2.67,3.31) 3.46,2.54 arc(5.59,1.32) 8,0.9
  Inner 3 w0.15: 45.69,107.94 45.91,107.94 v7(46.35,107.5)
  Inner 3 w1.1: v2(50,1.08) arc(49.97,1) 49.9,0.97
  Bottom Layer w1.1: 0.99,100.57 0.9,100.48 0.9,8 arc(0.96,7.07) 1.15,6.15 arc(1.5,5.13) 2.01,4.18 arc(2.67,3.31) 3.46,2.54 arc(5.59,1.32) 8,0.9 ; 8,1 8.1,0.9 v9(46.3,0.9) ; 46.28,0.9 119.76,0.9 ; v2(121.5,99.08) v1(125,99.08) 125.97,99.17 125.97,99.17 arc(126.02,99.18) 126.06,99.19 arc(129.56,98.27) 131.1,95 131.1,8 arc(129.02,2.98) 124,0.9 120.1,0.9 ; 119.76,0.97 arc(119.89,1) v2(120,1.08) arc(120.03,1) 120.1,0.97 ; 8.24,0.97 arc(8.11,1) v2(8,1.08)
  vias: v2(1.2,99.08) v2(1.2,89.08) v2(1.2,79.08) v2(1.2,69.08) v2(1.2,59.08) v2(1.2,49.08) v2(1.2,39.08) v2(1.2,29.08) v2(1.2,19.08) v2(1.2,9.08) v2(8,107.88) v2(17,107.88) v2(18,1.08) v2(26,107.88) v2(28,1.08) v2(30,107.88) v2(30,1.08) v2(39.5,107.58) v2(40,1.08) v2(57.5,101.08) v2(60,112.58) v2(60,1.08) v2(66.5,100.08) v2(70,1.08) v2(74.5,99.08) v2(75,112.58) v2(80,1.08) v2(81.5,112.58) v2(87.5,98.58) v2(90,1.08) v2(94.5,112.58) v2(99.5,98.58) v2(100,1.08) v2(106,112.58) v2(107.5,98.08) v2(110,1.08) v2(119.5,112.58) v2(130,112.08) v2(130.5,99.08) v2(130.8,89.08) v2(130.8,79.08) v2(130.8,69.08) v2(130.8,59.08) v2(130.8,49.08) v2(130.8,39.08) v2(130.8,29.08) v2(130.8,19.08) v2(130.8,9.08) v6(82.5,107.38) v6(83,108.38) v6(83.25,109.48) v6(83.3,104.98) v6(83.35,106.28) v6(85.25,101.58) v6(88.65,110.78) v6(88.83,107.43) v6(88.83,104.83) v6(89.15,111.78) v6(90.1,107.48) v6(90.1,104.78) v6(90.88,99.33) v6(91.43,107.43) v6(92.85,110.98) v6(95,109.63) v6(95,104.88) v6(97,108.68) v6(97.11,111.93) v6(99.2,106.88) v6(99.5,105.38) v6(113.98,105.38) v1(52.55,109.2) v1(54,111.58) v1(55.4,107.08) v1(58.1,104.48) v1(60.4,108.58) v1(62.1,104.48) v1(62.4,111.28) v1(62.5,113.08) v1(65.4,104.18) v1(65.5,102.88) v1(66,112.08) v1(68.3,104.78) v1(69,113.08) v1(72.2,110.48) v1(72.15,101.83) v1(73.2,110.48) v1(75,109.08) v1(76,101.08) v1(76.7,98.45) v1(77.5,109.08) v1(78,113.08) v1(79.6,106.88) v1(81.2,108.58) v1(81.4,105.98) v1(81.45,110.08) v1(82.6,111.38) v1(84.9,112.08) v1(85.2,113.18) v1(88.9,113.18) v1(90.3,108.38) v1(90.68,101.88) v1(93,113.08) v1(94.5,108.78) v1(98,112.58) v1(98.1,107.78) v1(100.1,107.78) v1(100.1,106.08) v1(101,112.58) v1(102,111.08) v1(102.5,107.08) v1(104,112.58) v1(103.95,111.1) v1(104,105.08) v1(104.75,111.1) v1(105.55,111.1) v1(105.9,101.65) v1(109.6,103.38) v1(110.6,101.58) v1(112.5,98.08) v1(112.8,103.78) v1(117.9,110.18) v1(118.4,113.38) v1(118.5,107.38) v1(119,104.08) v1(120,106.08) v1(123.9,101.28) v1(124.5,104.48) v1(125.8,112.38) v1(127.2,102.38) v1(128,99.08) v1(130.7,109.68) v3(1.15,6.15) v3(2,4.18) v3(3,96.08) v3(3.42,2.5) v3(5,98.08) v3(7,100.08) v3(10,101.08) v3(13,101.08) v3(16,101.08) v3(17.5,100.08) v3(19,99.08) v3(22,99.08) v3(23.5,100.08) v3(25,108.08) v3(25,100.08) v3(26,101.08) v3(28,100.08) v3(29,101.08) v3(30.5,104.93) v3(32,101.08) v3(35,101.08) v3(37,103.08) v3(37.3,108.18) v3(39,106.08) v3(49,110.08) v3(51.53,107.63) v3(55,110.08) v3(56,101.08) v3(57,111.58) v3(59,101.08) v3(62,101.08) v3(65,100.08) v3(68,100.08) v3(71,100.08) v3(73,99.58) v3(75.8,106.88) v3(80.6,103.93) v3(86,98.58) v3(89,98.58) v3(92,99.08) v3(96.8,105.28) v3(98,99.08) v3(99.8,109.78) v3(101,99.08) v3(109.5,98.08) v3(111,113.08) v3(111,98.08) v3(111.5,110.58) v3(112.6,105.38) v3(113.5,110.58) v3(114,113.08) v3(114,98.08) v3(120,99.08) v7(39.73,103.13) v7(41.28,102.88) v7(41.62,106.28) v7(45.05,107.48) v7(52.65,104.63) v7(54.2,104.78) v7(56.15,104.78) v7(66.55,107.48) v7(72.05,107.68) v7(72.95,111.48) v4(44.35,99.63) v4(45,100.93) v4(46.3,103.53) v4(46.3,101.58) v4(46.95,102.88) v4(48.25,102.88) v4(48.25,101.58) v5(59.7,109.6) v5(61.13,111.68) v5(61.15,110.88) v5(63.03,111.68) v5(67.28,110.88) v5(71.08,110.48) v5(95.39,101.67) v5(95.39,99.02) v5(96.19,99.02)
DRIVENSHIELD: length 507
  Inner 2 w0.05: 46.65,2.55 46.86,2.56 46.86,2.25 46.84,2.25 46.83,2.25 46.78,2.25 46.65,2.25 46.65,2.55
  Inner 2 w0.3: 7.97,91.68 7.09,91.68 4.42,89.02 4.42,31.36 4.95,30.83 4.95,4.41 6.96,2.4 46.96,2.4 ; 43.11,92.95 55.58,92.95 56.88,94.25 ; 57.7,97.88 v1(57.7,97.9) 57.7,98.03 58.45,98.78 60.8,98.78 62.95,96.63 71,96.63 71.28,96.35 85.33,96.35 85.95,95.73 101.33,95.73 101.8,95.25 119.58,95.25 120.82,96.5 126.13,96.5 128.08,94.55 128.08,66.48 127.7,66.1 127.7,62.68 127.5,62.48 127.5,59 127.28,58.78 127.28,55.13 126.95,54.8 126.95,51.55 126.75,51.35 126.75,47.9 126.53,47.68 126.53,43.93 125.9,43.3 125.9,2.7 125.6,2.4 47.88,2.4 ; 124.2,91.68 123.15,92.73 100.58,92.73 100.08,93.23 84.83,93.23 84.13,93.93 69.7,93.93 69.45,94.18 61.7,94.18 59.33,96.55 58.67,96.55 ; 37.47,97.37 35.7,95.6 28.55,95.6 27.4,94.45 26.53,94.45 25.4,93.33 18.3,93.33 17.65,92.68 9.5,92.68 8.5,91.68
  Inner 3 w0.3: v1(46.98,2.4) 52.85,2.4
  Bottom Layer w0.3: v1(57.7,97.9) 56.48,97.9 v4(50.2,104.18)
NETHFB.Q.1_D: length 25.4
  Top Layer w0.3: 113.47,100.42 113.11,100.42 arc(112.69,100.34) 112.33,100.1 ; 113.47,99.77 113.11,99.77 arc(112.69,99.86) 112.33,100.1 ; 111.18,99.77 111.54,99.77 arc(111.97,99.86) 112.33,100.1 ; 111.18,100.42 111.54,100.42 arc(111.97,100.34) 112.33,100.1
  Top Layer w0.9: 112.33,100.1 112.33,100.9
  Inner 1 w0.9: 126.98,110.28 v1(127.78,111.08) ; v9(112.33,100.9) 117.58,100.9 v1(126.95,110.28)
NETHFB.Q.1_G: length 22.9
  Top Layer w0.2: HFB.Q.1.G 110.68,99.13 109.65,100.15 v1(109.65,100.63) ; MCU.Ra.1.1 96.19,102.62 95.25,103.55 ; 95.25,103.55 94.08,104.73 MCU.U.5.18 ; 95.25,103.55 v1(96.08,103.55)
  Inner 1 w0.2: v1(96.08,103.55) 106.73,103.55 v1(109.65,100.63)
NETHFB.RA.6_1: length 48.5
  Top Layer w0.4: 72.94,109.48 REG.C.35.2 ; REG.U.4.3 71.3,111.65
  Top Layer w0.45: USB.FB.1.2 108.59,103.69 arc(108.69,103.54) 108.73,103.35 HFB.Ra.6.1
  Top Layer w0.6: REG.C.35.2 72.9,109.53 REG.U.4.1 71.01,109.53 arc(70.68,109.59) 70.4,109.78 arc(70.25,110) 70.2,110.26 70.2,110.7 arc(70.25,110.96) 70.4,111.18 arc(70.68,111.36) 71.01,111.43 REG.U.4.3
  Top Layer w0.8: v10(106.5,105.33) 106.95,105.33 USB.FB.1.2 ; 71.3,111.65 arc(71.38,112.05) v10(71.6,112.38)
  Inner 1 w0.8: v10(71.6,112.38) 73.45,112.38 74.3,111.53 81.03,111.53 82.03,110.53 85.8,110.53 86.7,109.63 93.43,109.63 94.2,110.4 97.33,110.4 98.93,108.8 102.38,108.8 105.85,105.33 v10(106.5,105.33)
NETHFB.RA.6_2: length 2.1
  Top Layer w0.5: HFB.Ra.6.8 108.73,100.78 arc(108.64,101.24) 108.38,101.63 108.3,101.71 arc(108.02,102.12) HFB.Ra.6.2
NETHFB.RA.6_3: length 2.1
  Top Layer w0.5: HFB.Ra.6.7 107.93,100.73 arc(107.84,101.19) 107.58,101.58 107.53,101.62 arc(107.23,102.07) HFB.Ra.6.3
NETHFB.RA.6_4: length 2.1
  Top Layer w0.5: HFB.Ra.6.6 arc(107.04,101.14) 106.79,101.51 106.77,101.54 arc(106.44,102.03) HFB.Ra.6.4
NETHFB.RA.6_5: length 23.8
  Top Layer w0.45: v1(106.33,100.33) HFB.Ra.6.5
  Inner 1 w0.45: v1(126.3,108.13) 126,108.13 117.98,100.1 106.55,100.1 v1(106.33,100.33)
NETMCU.C.9_1: length 5.8
  Top Layer w0.2: MCU.U.5.20 95.53,105.53 arc(95.8,105.58) 96.04,105.74 96.88,106.58 arc(96.97,106.72) 97,106.88 ; 97.8,105.38 97.5,105.68 arc(97.13,106.23) 97,106.88 ; MCU.Y.1.1 arc(97,106.88) 97,106.88
NETMCU.C.19_2: length 3.4
  Top Layer w0.27: MCU.Y.1.3 arc(98.83,109.23) 98.7,109.88 MCU.R.11.2 98.7,111.75 arc(98.72,111.85) MCU.C.19.2
NETMCU.D.1_1: length 23.3
  Top Layer w0.2: MCU.U.5.36 89.93,112.05 89.33,112.65 84.65,112.65 77,105 74.28,105 MCU.D.1.1
NETMCU.D.1_2: length 2.3
  Top Layer w1: 68.63,103.48 70.13,103.48 arc(70.52,103.56) MCU.D.1.2
NETMCU.J.1_2: length 4.5
  Top Layer w0.6: MCU.R.1.1 76.28,101.88 77.96,100.19 MCU.J.1.2
NETMCU.J.2_1: length 9.3
  Top Layer w0.2: MCU.U.5.24 92.69,107.13 arc(92.56,107.1) v5(92.45,107.03)
  Bottom Layer w0.3: MCU.J.2.1 98.56,102.17 95.2,105.53 93.95,105.53 v5(92.45,107.03)
NETMCU.J.2_2: length 12.3
  Top Layer w0.2: v5(92.45,107.88) 92.8,107.53 MCU.U.5.25
  Bottom Layer w0.3: MCU.J.2.2 100.8,102.08 99.64,103.24 98.09,103.24 95.4,105.93 94.4,105.93 v5(92.45,107.88)
NETMCU.R.1_2: length 13.6
  Top Layer w0.2: MCU.R.2.2 84.45,103.46 v1(84.5,103.5) 84.53,103.53 MCU.U.5.56
  Top Layer w0.4: MCU.R.1.2 76.24,103.88 MCU.U.1.1
  Inner 1 w0.2: v1(84.5,103.5) 84.13,103.13 77.6,103.13 v3(76.8,103.93)
NETMCU.R.11_1: length 6.8
  Top Layer w0.2: MCU.R.11.1 96.65,110.3 arc(96.09,109.48) 95.9,108.5 95.9,106.38 arc(95.77,106.06) 95.45,105.93 MCU.U.5.21
NETMCU.RA.1_3: length 57.7
  Top Layer w0.15: MCU.U.5.3 v1(88.33,103.78)
  Inner 1 w0.15: v5(94.59,101.67) 94.59,102.64 93.88,103.35 93.1,103.35 92.68,103.78 v1(88.33,103.78) 87.13,103.78 85.88,102.53 77.26,102.53 75.81,103.98 68.21,103.98 64.14,108.05 57.53,108.05 55.88,106.4 49.33,106.4 47.8,104.88 46.53,104.88 45.98,104.33 45.98,102.55 v4(45.65,102.23)
NETMCU.RA.1_4: length 55.5
  Top Layer w0.2: v1(93.6,102.88) 93.55,102.93 MCU.U.5.15
  Inner 1 w0.15: v5(93.79,101.67) 93.6,101.86 v1(93.6,102.88) 93.05,102.88 92.55,103.38 87.2,103.38 86.1,102.28 77.15,102.28 75.7,103.73 68.11,103.73 64.03,107.8 57.65,107.8 56,106.15 49.43,106.15 47.86,104.58 47.58,104.58 47.28,104.28 47.28,103.33 47.4,103.2 48.58,103.2 v4(48.9,102.88)
NETMCU.U.1_2: length 9.1
  Top Layer w0.2: v1(85.1,104.03) 85.2,103.93 MCU.U.5.55
  Inner 1 w0.2: v3(78.08,103.93) 78.55,103.45 83.78,103.45 84.35,104.03 v1(85.1,104.03)
NETMCU.U.1_3: length 7.7
  Top Layer w0.2: MCU.U.5.54 85.88,104.33 v1(85.78,104.43)
  Inner 1 w0.2: v1(85.78,104.43) 85.7,104.5 79.9,104.5 v3(79.33,103.93)
NETMCU.U.1_5: length 12.3
  Top Layer w0.2: MCU.U.5.53 88,104.73 v1(88.03,104.75)
  Inner 1 w0.2: v1(88.03,104.75) 88.05,104.78 88.05,105.45 86.78,106.73 82.35,106.73 80.6,108.48 v3(80.6,110.03)
NETMCU.U.1_6: length 11.7
  Top Layer w0.2: v1(87.6,105.33) 87.4,105.13 MCU.U.5.52
  Inner 1 w0.2: v1(87.6,105.33) 87.15,105.78 82.8,105.78 79.33,109.25 v3(79.33,110.03)
NETMCU.U.1_7: length 10.8
  Top Layer w0.2: MCU.U.5.51 86.13,105.53 v1(85.8,105.2)
  Inner 1 w0.2: v3(78.08,110.03) 82.68,105.43 85.58,105.43 v1(85.8,105.2)
NETMCU.U.5_2: length 46.6
  Top Layer w0.15: MCU.U.5.2 87.93,101.88 v1(87.83,101.78)
  Inner 4 w0.15: v4(46.3,102.23) 46.63,102.55 47.1,102.55 47.28,102.73 47.28,104.4 48.68,105.8 80.28,105.8 83.61,102.48 87.13,102.48 v1(87.83,101.78)
NETMCU.U.5_4: length 47.1
  Top Layer w0.15: MCU.U.5.4 88.73,101.78 v1(88.6,101.65)
  Inner 4 w0.15: v4(46.3,102.88) 46.63,103.2 46.63,104.13 48.55,106.05 80.38,106.05 83.71,102.73 87.53,102.73 v1(88.6,101.65)
NETMCU.U.5_6: length 46.8
  Top Layer w0.15: v1(89.4,101.78) 89.53,101.9 MCU.U.5.6
  Inner 4 w0.15: v1(89.4,101.78) 88.2,102.98 83.81,102.98 80.49,106.3 48.43,106.3 v4(46.3,104.18)
NETMCU.U.5_7: length 48.7
  Top Layer w0.15: v1(89.15,100.75) 89.28,100.75 89.93,101.4 MCU.U.5.7
  Inner 4 w0.15: v1(89.15,100.75) 89.18,100.78 87.15,100.78 85.95,101.98 83.4,101.98 80.07,105.3 48.93,105.3 48.58,104.95 48.58,103.35 48.43,103.2 48.13,103.2 47.15,102.23 v4(46.95,102.23)
NETMCU.U.5_8: length 47.7
  Top Layer w0.15: MCU.U.5.8 90.32,102.7 90.32,102.15 90.2,102.03 90.2,101.13 v1(89.98,100.9)
  Inner 4 w0.15: v1(89.98,100.9) 89.65,101.23 87.73,101.23 87.4,101.55 87.4,101.75 86.93,102.23 83.5,102.23 80.18,105.55 48.8,105.55 47.93,104.68 47.93,103.85 v4(47.6,103.53)
NETMCU.U.5_11: length 50.3
  Top Layer w0.15: MCU.U.5.11 91.53,101.6 v1(91.65,101.48)
  Inner 1 w0.15: v1(91.65,101.48) 90.48,101.48 90.35,101.35 89.2,101.35 88.68,100.83 82.38,100.83 81.18,102.03 77.05,102.03 75.6,103.48 68.01,103.48 63.93,107.55 57.9,107.55 v5(57.3,106.95) 56.25,105.9 49.55,105.9 47.93,104.28 47.93,103.85 v4(48.25,103.53)
NETMCU.U.5_12: length 50
  Top Layer w0.15: MCU.U.5.12 91.93,101.8 92.08,101.65 92.08,101 v1(91.83,100.75)
  Inner 1 w0.15: v1(91.83,100.75) 91.43,100.35 88.9,100.35 88.68,100.58 82.28,100.58 81.08,101.78 76.95,101.78 75.5,103.23 67.9,103.23 63.83,107.3 58.45,107.3 v5(58.1,106.95) 56.8,105.65 49.73,105.65 v4(48.25,104.18)
NETMCU.U.5_14: length 52.7
  Top Layer w0.12: v1(92,100.08) 92.73,100.8 MCU.U.5.14
  Inner 1 w0.15: v4(47.6,102.23) 47.93,102.55 49.08,102.55 49.23,102.7 49.23,103.65 50.95,105.38 57.33,105.38 v5(58.9,106.95) 63.68,106.95 67.76,102.88 75.35,102.88 76.7,101.53 80.98,101.53 82.18,100.33 88.55,100.33 88.8,100.08 v1(92,100.08)
NETMCU.U.5_46: length 32.9
  Top Layer w0.2: MCU.U.5.46 v1(87.73,107.53) ; USB.R.3.2 117.31,102.15 arc(117.14,102.18) v1(117,102.28)
  Inner 1 w0.2: v1(87.73,107.53) 87.93,107.53 89.75,105.7 91.88,105.7 93.3,104.28 111.4,104.28 113.4,102.28 v1(117,102.28)
NETMCU.U.5_47: length 27
  Top Layer w0.2: MCU.U.5.47 87.43,107.13 v1(87.83,106.73) ; v1(111.6,103.08) 111.6,103.03 arc(111.64,102.84) USB.R.4.2
  Inner 1 w0.2: v1(87.83,106.73) 88.25,106.73 89.6,105.38 91.7,105.38 93.1,103.98 110.7,103.98 v1(111.6,103.08)
NETREG.RA.3_5: length 2.4
  Top Layer w0.3: REG.Ra.4.4 REG.Ra.3.5 REG.Ra.3.6
NETREG.RA.3_7: length 2.4
  Top Layer w0.3: REG.Ra.4.3 REG.Ra.4.2 REG.Ra.3.7
NETREG.RA.4_5: length 3.1
  Top Layer w0.3: REG.Ra.4.5 REG.Ra.4.6 67.2,110.08 68.55,111.43 REG.U.4.4
NETTCN.C.10_1: length 3.8
  Top Layer w0.25: TCN.C.10.1 48.9,106.9 48.9,104.18
NETTCN.C.10_2: length 2.7
  Top Layer w0.2: TCN.C.10.2 48.58,105.53 48.58,103.85 48.9,103.53
NETTCN.C.11_1: length 4.6
  Top Layer w0.2: TCN.U.2.H3 49.23,103.85 49.23,104.4 49.29,104.47
  Top Layer w0.25: TCN.C.11.1 49.29,106.84 49.29,104.47
NETTCN.C.11_2: length 2
  Top Layer w0.25: TCN.C.11.2 50.08,104.7 TCN.U.2.J3
NETTCN.C.12_2: length 63
  Top Layer w0.2: 48.58,99.3 49.23,99.3 ; 48.58,99.3 48.58,99.95 ; 48.58,99.3 47.93,99.3 ; 48.58,99.3 48.58,98.58 ; 49.23,99.3 TCN.U.2.A3 ; 49.23,99.3 49.23,99.95 ; 46.63,99.3 47.28,99.3 ; 46.63,99.3 45.33,99.3 ; 46.63,99.3 46.63,99.95 ; 46.63,99.3 46.63,98.58 ; 47.28,99.3 47.28,98.58 ; 47.28,99.3 47.93,99.3 ; 47.28,99.3 47.28,99.95 ; 44.68,98.58 44.68,99.3 ; 44.68,98.58 45.33,98.58 ; 44.68,98.58 44.03,98.58 ; 44.68,98.58 44.68,97.68 TCN.C.16.2 44.03,97.53 44.03,98.58 ; 44.68,99.3 44.68,99.95 ; 44.68,99.3 44.03,99.3 ; 44.68,99.3 45.33,99.3 ; 44.03,99.3 44.03,99.95 TCN.U.2.C11 ; 44.03,99.3 44.03,98.58 ; 47.28,98.58 47.93,98.58 ; 47.28,98.58 47.28,97.48 TCN.C.12.2 ; 47.28,98.58 46.63,98.58 ; 45.33,99.3 45.33,99.95 ; 45.33,99.3 45.33,98.58 ; 45.33,98.58 46.63,98.58 ; TCN.C.12.2 47.93,97.18 47.93,98.58 ; TCN.C.12.2 47.4,97.01 46.63,97.78 46.63,98.58 ; TCN.C.12.2 48,97.01 48.58,97.58 48.58,98.58 ; 47.93,98.58 47.93,99.3 ; 47.93,98.58 48.58,98.58 ; 45.33,99.95 46.63,99.95 ; 45.33,99.95 44.68,99.95 ; 45.33,99.95 45.33,100.6 ; TCN.U.2.C11 44.68,99.95 ; TCN.U.2.C11 44.68,100.6 ; 46.63,99.95 47.28,99.95 ; 49.23,99.95 48.58,99.95 ; 49.23,99.95 49.23,100.6 ; 47.93,100.6 48.58,100.6 ; 47.93,100.6 45.33,100.6 ; 47.93,100.6 47.93,99.95 ; 47.93,100.6 47.93,102.38 48.1,102.55 48.75,102.55 ; 48.58,100.6 48.58,102.38 48.75,102.55 ; 48.58,100.6 49.23,100.6 ; 48.58,100.6 48.58,99.95 ; 49.23,100.6 49.23,102.55 ; 49.23,102.55 48.75,102.55 ; 49.23,102.55 TCN.U.2.G3 49.88,103.2 49.88,103.73 50,103.85 51,103.85 51.5,104.35 51.5,105.9 TCN.C.15.2 ; 48.58,99.95 47.93,99.95 ; 47.93,99.3 47.93,99.95 ; 47.93,99.95 47.28,99.95 ; 48.58,98.58 49.55,98.58 ; 44.68,100.6 44.68,101.25 TCN.U.2.E10 45.33,101.25 45.33,100.6 ; 44.68,100.6 45.33,100.6
  Top Layer w0.25: 47.93,97.18 48.02,97.28 TCN.C.14.2 49.55,97.45 TCN.U.2.A3
NETTCN.C.31_2: length 14.5
  Top Layer w0.2: 45.98,103.85 46.63,103.85 ; 45.98,103.85 45.98,103.23 ; 45.98,103.85 45.98,104.73 45.05,105.65 TCN.C.32.2 45.2,105.78 46.63,104.35 46.63,103.85 ; 46.63,103.85 46.63,103.2 ; 46.63,102.73 46.8,102.55 47.08,102.55 47.28,102.35 47.28,101.9 ; 46.63,102.73 46.45,102.55 45.98,102.55 ; 46.63,102.73 46.63,103.2 ; 47.28,101.9 46.15,101.9 45.98,102.08 45.98,102.55 ; 47.28,101.9 TCN.U.2.E6 ; 45.98,103.23 46,103.2 46.63,103.2 ; 45.98,103.23 45.98,102.55
  Top Layer w1: TCN.C.32.2 44.23,105.78 TCN.C.31.2
NETUSB.FB.1_1: length 12
  Top Layer w0.5: 110.47,105.38 USB.Z.1.5 110.75,106.2 arc(110.69,106.53) 110.5,106.8 arc(110.26,107.16) 110.18,107.59 USB.J.3.11 110.18,108.34 arc(110.22,108.54) 110.33,108.7 110.61,108.99 arc(111.1,109.31) 111.68,109.43 113.13,109.43 arc(113.98,109.26) 114.7,108.78 arc(114.83,108.58) 114.88,108.36 USB.J.3.2 ; 110.47,105.38 110.37,105.38 ; 110.47,105.38 arc(109.94,105.48) 109.5,105.78 arc(108.95,106.15) 108.29,106.28
NETUSB.FB.2_1: length 6.6
  Top Layer w0.27: USB.J.3.8 111.78,108.58 arc(111.86,108.79) 112.08,108.88 112.95,108.88 arc(113.18,108.78) 113.28,108.55 USB.J.3.5 113.28,107.23 arc(113.37,106.74) 113.65,106.33 114.36,106.33 arc(114.88,106.22) USB.FB.2.1
NETUSB.FB.2_2: length 1.8
  Top Layer w0.27: USB.FB.2.2 117.33,104.33 arc(117.35,104.24) USB.R.3.1
NETUSB.FB.3_1: length 8.9
  Top Layer w0.27: USB.J.3.7 112.28,106.67 arc(112.24,106.47) 112.13,106.3 ; 112.13,106.3 112.62,106.79 arc(112.74,106.97) 112.78,107.18 USB.J.3.6 ; 112.13,106.3 arc(111.92,106) 111.85,105.64 111.85,105.28 arc(111.92,104.95) 112.1,104.68 arc(112.38,104.49) 112.7,104.43 114.87,104.43 arc(115.22,104.36) USB.FB.3.1
NETUSB.FB.3_2: length 1.9
  Top Layer w0.27: USB.FB.3.2 115.03,102.15 arc(114.34,102.29) USB.R.4.1
NETUSB.J.3_3: length 12.6
  Top Layer w0.27: v5(114.28,107.03) USB.J.3.3
  Top Layer w0.4: USB.Ra.5.5 USB.Ra.5.6
  Inner 1 w0.27: v5(104.33,107.88) 105.85,106.35 113.6,106.35 v5(114.28,107.03)
NETUSB.J.3_9: length 8.4
  Top Layer w0.27: v5(111.28,107.05) USB.J.3.9
  Top Layer w0.4: USB.Ra.5.7 USB.Ra.5.8
  Inner 1 w0.27: v5(105.13,107.88) 106.28,106.73 110.95,106.73 v5(111.28,107.05)
X0: length 124
  Top Layer w0.15: v10(9,90.18) 10.23,91.4 13.69,91.4 13.93,91.64 19.58,91.64 19.62,91.6 21.1,91.6 21.14,91.64 28.69,91.64 30.03,92.98 36.91,92.98 42.91,98.98 43.05,98.98
  Inner 1 w0.15: 9.18,4.08 8.99,4.26 ; 9,4.08 v10(9,4.18) ; 9,90.18 v10(9,90.18) v10(9,87.08) v10(9,83.28) v10(9,79.48) v10(9,75.68) v10(9,71.88) v10(9,68.08) v10(9,64.28) v10(9,60.48) v10(9,56.68) v10(9,52.88) v10(9,49.08) v10(9,45.28) v10(9,41.48) v10(9,37.68) v10(9,33.88) v10(9,30.08) v10(9,26.28) v10(9,22.48) v10(9,18.68) v10(9,14.88) v10(9,11.08) v10(9,7.28) 9,4.26
X1: length 120.8
  Top Layer w0.15: v10(12.8,90.18) 14.03,91.4 19.48,91.4 19.52,91.36 21.2,91.36 21.24,91.4 28.8,91.4 30.13,92.73 37,92.73 42.92,98.65 43.38,98.65 TCN.U.2.A12
  Inner 1 w0.15: 12.8,4 v10(12.8,7.28) v10(12.8,11.08) v10(12.8,14.88) v10(12.8,18.68) v10(12.8,22.48) v10(12.8,26.28) v10(12.8,30.08) v10(12.8,33.88) v10(12.8,37.68) v10(12.8,41.48) v10(12.8,45.28) v10(12.8,49.08) v10(12.8,52.88) v10(12.8,56.68) v10(12.8,60.48) v10(12.8,64.28) v10(12.8,68.08) v10(12.8,71.88) v10(12.8,75.68) v10(12.8,79.48) v10(12.8,83.28) v10(12.8,87.08) v10(12.8,90.18)
  vias: v10(12.8,4.18)
X2: length 117.2
  Top Layer w0.15: 43.05,99.63 42.88,99.63 36.73,93.48 29.75,93.48 28.4,92.13 21.95,92.13 21.65,92.43 20.2,92.43 v1(19.8,92.03)
  Inner 1 w0.15: 16.6,4.11 v10(16.6,7.28) v10(16.6,11.08) v10(16.6,14.88) v10(16.6,18.68) v10(16.6,22.48) v10(16.6,26.28) v10(16.6,30.08) v10(16.6,33.88) v10(16.6,37.68) v10(16.6,41.48) v10(16.6,45.28) v10(16.6,49.08) v10(16.6,52.88) v10(16.6,56.68) v10(16.6,60.48) v10(16.6,64.28) v10(16.6,68.08) v10(16.6,71.88) v10(16.6,75.68) v10(16.6,79.48) v10(16.6,83.28) v10(16.6,87.08) v10(16.6,90.18) 18.45,92.03 v1(19.8,92.03) ; 16.6,4.08 v10(16.6,4.18)
  Bottom Layer w0.15: v10(16.6,90.18) 16.86,90.44
X3: length 114.3
  Top Layer w0.15: v1(20.92,92.03) 21.07,91.88 28.53,91.88 29.88,93.23 36.82,93.23 42.89,99.3 43.38,99.3 TCN.U.2.B12
  Inner 1 w0.15: 20.4,4.26 v10(20.4,7.28) v10(20.4,11.08) v10(20.4,14.88) v10(20.4,18.68) v10(20.4,22.48) v10(20.4,26.28) v10(20.4,30.08) v10(20.4,33.88) v10(20.4,37.68) v10(20.4,41.48) v10(20.4,45.28) v10(20.4,49.08) v10(20.4,52.88) v10(20.4,56.68) v10(20.4,60.48) v10(20.4,64.28) v10(20.4,68.08) v10(20.4,71.88) v10(20.4,75.68) v10(20.4,79.48) v10(20.4,83.28) v10(20.4,87.08) v10(20.4,90.18) 20.4,91.5 v1(20.92,92.03) ; 20.4,4.08 v10(20.4,4.18)
  Bottom Layer w0.15: v10(20.4,90.18) 20.52,90.3
X8:
  vias: v4(44.35,100.93)
X11:
  vias: v4(44.35,101.58)
X12:
  vias: v4(43.05,102.23)
X13:
  vias: v4(43.7,102.23)
X14: length 112.3
  Inner 1 w0.15: 24.2,4.08 v10(24.2,7.28) v10(24.2,11.08) v10(24.2,14.88) v10(24.2,18.68) v10(24.2,64.28) v10(24.2,68.08) v10(24.2,90.18) 25.43,91.4 35.08,91.4 42.83,99.15 42.83,99.16 43.3,99.63 43.3,100.78 43.78,101.25 43.78,101.38 44.05,101.65 44.05,101.93 v4(44.35,102.23) ; 24.2,4.08 v10(24.2,4.18) ; 24.2,4.08 24.2,4
  vias: v10(24.2,87.08) v10(24.2,83.28) v10(24.2,79.48) v10(24.2,75.68) v10(24.2,71.88) v10(24.2,60.48) v10(24.2,56.68) v10(24.2,52.88) v10(24.2,49.08) v10(24.2,45.28) v10(24.2,41.48) v10(24.2,37.68) v10(24.2,33.88) v10(24.2,30.08) v10(24.2,26.28) v10(24.2,22.48)
X15: length 107.5
  Top Layer w0.15: v10(28,90.18) 29.48,91.65 33.3,91.65 v1(33.93,92.28)
  Inner 1 w0.15: v4(43.05,102.88) 42.68,102.5 42.68,101.73 42.3,101.35 42.3,100.43 34.68,92.8 34.45,92.8 v1(33.93,92.28) ; v10(28,90.18) v10(28,68.08) v10(28,64.28) v10(28,18.68) v10(28,14.88) v10(28,11.08) v10(28,7.28) 28,4.11 ; 28,4.08 v10(28,4.18)
  vias: v10(28,87.08) v10(28,83.28) v10(28,79.48) v10(28,75.68) v10(28,71.88) v10(28,60.48) v10(28,56.68) v10(28,52.88) v10(28,49.08) v10(28,45.28) v10(28,41.48) v10(28,37.68) v10(28,33.88) v10(28,30.08) v10(28,26.28) v10(28,22.48)
X16: length 104.3
  Top Layer w0.15: v1(34.9,92.15) 34.15,91.4 33.03,91.4 v10(31.8,90.18)
  Inner 1 w0.15: 31.8,4.08 v10(31.8,4.18) ; 31.8,4.26 v10(31.8,7.28) v10(31.8,11.08) v10(31.8,14.88) v10(31.8,18.68) v10(31.8,64.28) v10(31.8,68.08) v10(31.8,90.18) ; v4(43.7,102.88) 43.7,102.68 43.38,102.35 43.38,101.75 43.2,101.58 43.2,101.45 42.8,101.05 42.8,100.05 v1(34.9,92.15)
  vias: v10(31.8,87.08) v10(31.8,83.28) v10(31.8,79.48) v10(31.8,75.68) v10(31.8,71.88) v10(31.8,60.48) v10(31.8,56.68) v10(31.8,52.88) v10(31.8,49.08) v10(31.8,45.28) v10(31.8,41.48) v10(31.8,37.68) v10(31.8,33.88) v10(31.8,30.08) v10(31.8,26.28) v10(31.8,22.48)
X17: length 107.2
  Inner 1 w0.15: v4(43.05,103.53) 42.9,103.53 42.18,102.8 42.18,101.98 41.8,101.6 41.8,100.68 34.43,93.3 33.65,93.3 32.65,92.3 v1(32.45,92.3) ; 35.6,4 v10(35.6,7.28) v10(35.6,11.08) v10(35.6,14.88) v10(35.6,18.68) v10(35.6,64.28) v10(35.6,68.08) v10(35.6,90.18)
  Inner 3 w0.15: v1(32.45,92.3) 33.35,91.4 34.38,91.4 v10(35.6,90.18)
  Bottom Layer w0.15: 34.9,3.58 35.43,4.11
  vias: v10(35.6,87.08) v10(35.6,83.28) v10(35.6,79.48) v10(35.6,75.68) v10(35.6,71.88) v10(35.6,60.48) v10(35.6,56.68) v10(35.6,52.88) v10(35.6,49.08) v10(35.6,45.28) v10(35.6,41.48) v10(35.6,37.68) v10(35.6,33.88) v10(35.6,30.08) v10(35.6,26.28) v10(35.6,22.48) v10(35.6,4.18)
X18: length 109.4
  Inner 1 w0.15: v10(39.4,90.18) v10(39.4,68.08) v10(39.4,64.28) v10(39.4,18.68) v10(39.4,14.88) v10(39.4,11.08) v10(39.4,7.28) 39.4,4.11 ; 39.4,4.08 v10(39.4,4.18) ; v1(33.2,92.3) 33.4,92.3 34.15,93.05 34.55,93.05 42.05,100.55 42.05,101.48 42.43,101.85 42.43,102.68 42.95,103.2 43.38,103.2 v4(43.7,103.53)
  Inner 3 w0.15: v1(33.2,92.3) 33.85,91.65 35.08,91.65 35.35,91.38 38.2,91.38 v10(39.4,90.18)
  vias: v10(39.4,87.08) v10(39.4,83.28) v10(39.4,79.48) v10(39.4,75.68) v10(39.4,71.88) v10(39.4,60.48) v10(39.4,56.68) v10(39.4,52.88) v10(39.4,49.08) v10(39.4,45.28) v10(39.4,41.48) v10(39.4,37.68) v10(39.4,33.88) v10(39.4,30.08) v10(39.4,26.28) v10(39.4,22.48)
X19: length 101.7
  Inner 1 w0.15: 43.2,4.08 v10(43.2,4.18) ; 43.2,4.26 v10(43.2,7.28) v10(43.2,11.08) v10(43.2,14.88) v10(43.2,18.68) v10(43.2,64.28) v10(43.2,68.08) v10(43.2,90.18) 43.2,98.43 44.05,99.28 44.05,100.4 44.25,100.6 44.48,100.6 44.68,100.8 44.68,103 43.83,103.85 43.38,103.85 v4(43.05,104.18)
  vias: v10(43.2,87.08) v10(43.2,83.28) v10(43.2,79.48) v10(43.2,75.68) v10(43.2,71.88) v10(43.2,60.48) v10(43.2,56.68) v10(43.2,52.88) v10(43.2,49.08) v10(43.2,45.28) v10(43.2,41.48) v10(43.2,37.68) v10(43.2,33.88) v10(43.2,30.08) v10(43.2,26.28) v10(43.2,22.48)
X20: length 104.3
  Inner 1 w0.15: 47,4 v10(47,7.28) v10(47,11.08) v10(47,14.88) v10(47,18.68) v10(47,64.28) v10(47,68.08) v10(47,90.18) 45.85,91.33 44.25,91.33 43.45,92.13 43.45,97.65 44.65,98.85 44.65,100.4 44.85,100.6 45.15,100.6 45.33,100.78 45.33,102.73 43.88,104.18 v4(43.7,104.18)
  vias: v10(47,87.08) v10(47,83.28) v10(47,79.48) v10(47,75.68) v10(47,71.88) v10(47,60.48) v10(47,56.68) v10(47,52.88) v10(47,49.08) v10(47,45.28) v10(47,41.48) v10(47,37.68) v10(47,33.88) v10(47,30.08) v10(47,26.28) v10(47,22.48) v10(47,4.18)
X21: length 103.3
  Top Layer w0.15: v10(50.8,90.18) 52.23,91.6 55.83,91.6 57.4,93.18 57.4,93.7 52.13,98.98 TCN.U.2.A1
  Inner 1 w0.15: 50.8,4.11 v10(50.8,7.28) v10(50.8,11.08) v10(50.8,14.88) v10(50.8,18.68) v10(50.8,22.48) v10(50.8,26.28) v10(50.8,30.08) v10(50.8,33.88) v10(50.8,37.68) v10(50.8,41.48) v10(50.8,45.28) v10(50.8,49.08) v10(50.8,52.88) v10(50.8,56.68) v10(50.8,60.48) v10(50.8,64.28) v10(50.8,68.08) v10(50.8,71.88) v10(50.8,75.68) v10(50.8,79.48) v10(50.8,83.28) v10(50.8,87.08) v10(50.8,90.18) ; 50.8,4.08 v10(50.8,4.18)
X22: length 100.9
  Top Layer w0.15: v10(54.6,90.18) 54.75,90.18 57.65,93.08 57.65,93.8 52.15,99.3 50.53,99.3 TCN.U.2.A2
  Inner 1 w0.15: v10(54.6,90.18) v10(54.6,87.08) v10(54.6,83.28) v10(54.6,79.48) v10(54.6,75.68) v10(54.6,71.88) v10(54.6,68.08) v10(54.6,64.28) v10(54.6,60.48) v10(54.6,56.68) v10(54.6,52.88) v10(54.6,49.08) v10(54.6,45.28) v10(54.6,41.48) v10(54.6,37.68) v10(54.6,33.88) v10(54.6,30.08) v10(54.6,26.28) v10(54.6,22.48) v10(54.6,18.68) v10(54.6,14.88) v10(54.6,11.08) v10(54.6,7.28) 54.6,4.26 ; 54.6,4.08 v10(54.6,4.18)
X23: length 99.7
  Top Layer w0.15: TCN.U.2.B1 50.87,99.61 52.2,99.61 58.4,93.4 v10(58.4,90.18)
  Inner 1 w0.15: 58.4,4 v10(58.4,7.28) v10(58.4,11.08) v10(58.4,14.88) v10(58.4,18.68) v10(58.4,22.48) v10(58.4,26.28) v10(58.4,30.08) v10(58.4,33.88) v10(58.4,37.68) v10(58.4,41.48) v10(58.4,45.28) v10(58.4,49.08) v10(58.4,52.88) v10(58.4,56.68) v10(58.4,60.48) v10(58.4,64.28) v10(58.4,68.08) v10(58.4,71.88) v10(58.4,75.68) v10(58.4,79.48) v10(58.4,83.28) v10(58.4,87.08) v10(58.4,90.18)
  Bottom Layer w0.15: 58.57,90.25 arc(58.49,90.2) v10(58.4,90.18)
  vias: v10(58.4,4.18)
X24: length 102.3
  Top Layer w0.15: v10(62.2,90.18) 60.65,91.73 60.43,91.73 52.2,99.95 50.53,99.95 TCN.U.2.B2
  Inner 1 w0.15: 62.2,4.11 v10(62.2,7.28) v10(62.2,11.08) v10(62.2,14.88) v10(62.2,18.68) v10(62.2,22.48) v10(62.2,26.28) v10(62.2,30.08) v10(62.2,33.88) v10(62.2,37.68) v10(62.2,41.48) v10(62.2,45.28) v10(62.2,49.08) v10(62.2,52.88) v10(62.2,56.68) v10(62.2,60.48) v10(62.2,64.28) v10(62.2,68.08) v10(62.2,71.88) v10(62.2,75.68) v10(62.2,79.48) v10(62.2,83.28) v10(62.2,87.08) v10(62.2,90.18) ; 62.2,4.08 v10(62.2,4.18)
X25: length 105.3
  Inner 1 w0.15: v4(50.85,100.28) 50.98,100.28 59.85,91.4 64.78,91.4 v10(66,90.18) v10(66,87.08) v10(66,83.28) v10(66,79.48) v10(66,75.68) v10(66,71.88) v10(66,68.08) v10(66,64.28) v10(66,60.48) v10(66,56.68) v10(66,52.88) v10(66,49.08) v10(66,45.28) v10(66,41.48) v10(66,37.68) v10(66,33.88) v10(66,30.08) v10(66,26.28) v10(66,22.48) v10(66,18.68) v10(66,14.88) v10(66,11.08) v10(66,7.28) 66,4.26 ; 66,4.08 v10(66,4.18)
